# Altium project AMBIT.PrjPcb (part 2 of 3)

## Sheet Microcontroller.SchDoc: Microcontroller
size Tabloid; DocumentNumber: 1; Revision: 0.4b; SheetNumber: 1; SheetTotal: 11
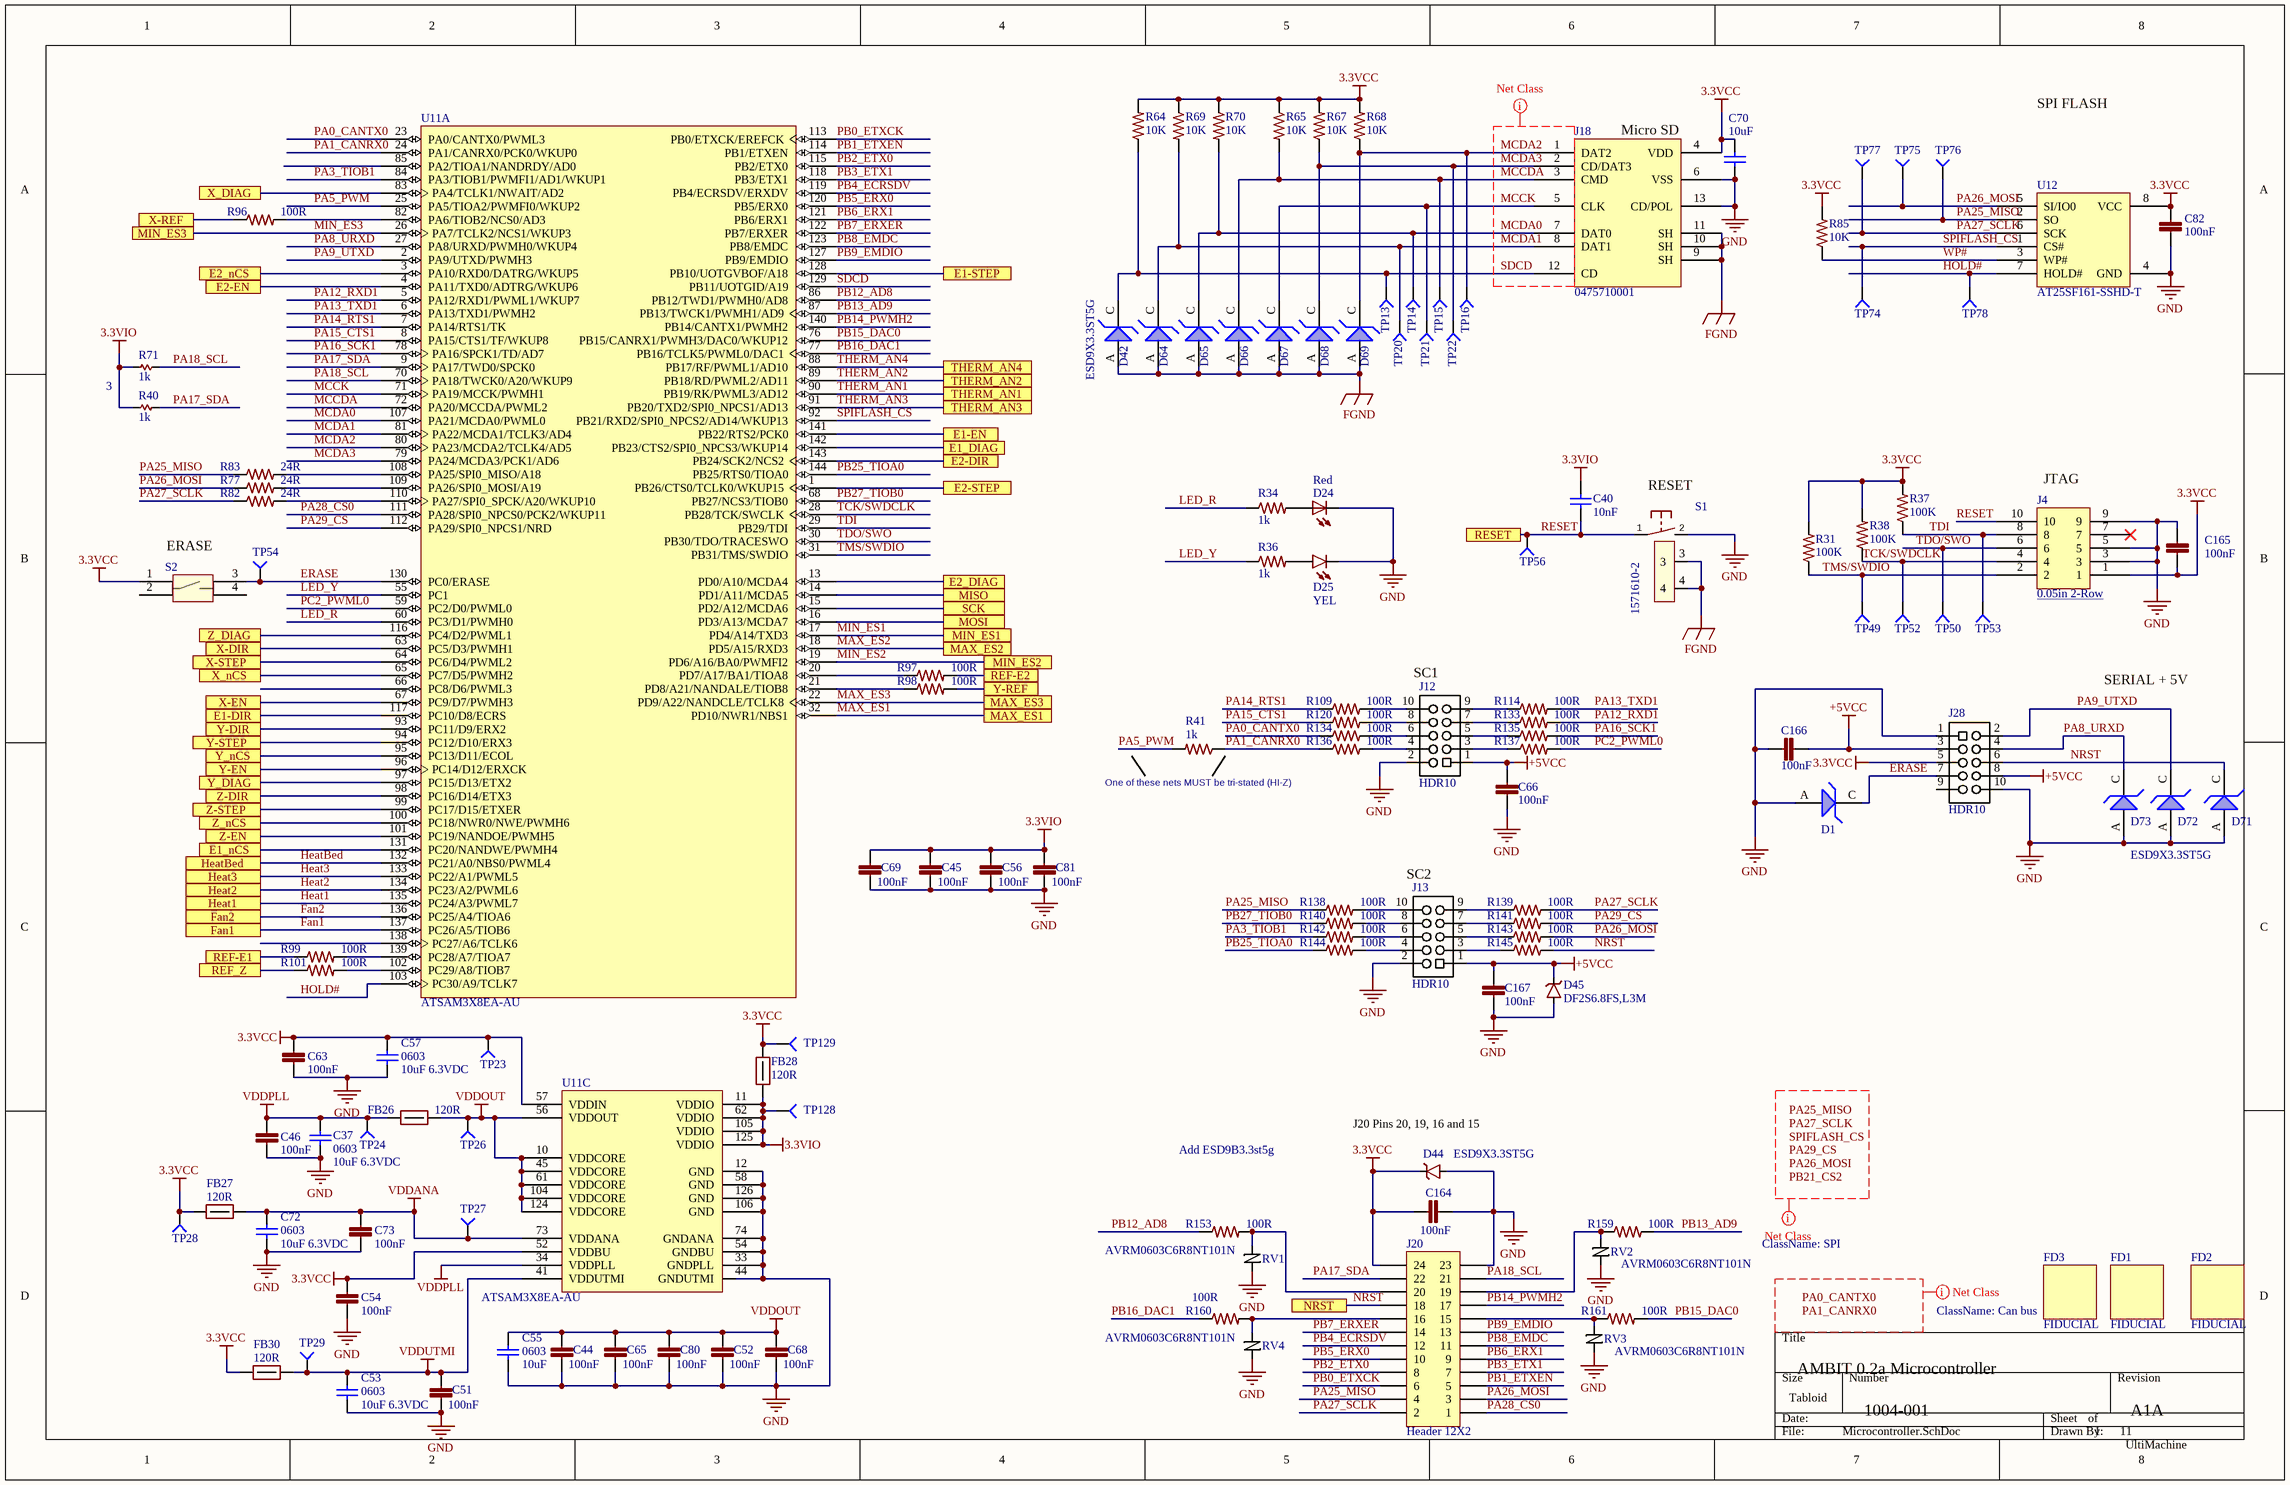
[diagram p3: Microcontroller.SchDoc]

### Parts
(Parts that share a designator on the sheet are numbered #1, #2 ... from top to bottom, then left to right.)
C37  0603  value 10uF 6.3VDC  [C0603]
C40  10nF  [C0402]
C44  100nF  [C0402]
C45  100nF  [C0402]
C46  100nF  [C0402]
C51  100nF  [C0402]
C52  100nF  [C0402]
C53  0603  value 10uF 6.3VDC  [C0603]
C54  100nF  [C0402]
C55  0603  value 10uF  [C0603]
C56  100nF  [C0402]
C57  0603  value 10uF 6.3VDC  [C0603]
C63  100nF  [C0402]
C65  100nF  [C0402]
C66  100nF  [C0402]
C68  100nF  [C0402]
C69  100nF  [C0402]
C70  value 10uF  [C0603]  (hidden comment: 0603)
C72  0603  value 10uF 6.3VDC  [C0603]
C73  100nF  [C0402]
C80  100nF  [C0402]
C81  100nF  [C0402]
C82  100nF  [C0402]
C164  100nF  [C0402]
C165  100nF  [C0402]
C166  100nF  [C0402]
C167  100nF  [C0402]
D1  ESD9X3.3ST5G  [SOD923-100X40-2N]  (value not drawn)
D24  Red  [LED2012120]
D25  YEL  [LED2012120]
D42  ESD9X3.3ST5G  [SOD923-100X40-2N]
D44  ESD9X3.3ST5G  [SOD923-D]
D45  DF2S6.8FS,L3M  [SOD923-D]
D64  ESD9X3.3ST5G  [SOD923-100X40-2N]  (value not drawn)
D65  ESD9X3.3ST5G  [SOD923-100X40-2N]  (value not drawn)
D66  ESD9X3.3ST5G  [SOD923-100X40-2N]  (value not drawn)
D67  ESD9X3.3ST5G  [SOD923-100X40-2N]  (value not drawn)
D68  ESD9X3.3ST5G  [SOD923-100X40-2N]  (value not drawn)
D69  ESD9X3.3ST5G  [SOD923-100X40-2N]  (value not drawn)
D71  ESD9X3.3ST5G  [SOD923-100X40-2N]
D72  ESD9X3.3ST5G  [SOD923-100X40-2N]  (value not drawn)
D73  ESD9X3.3ST5G  [SOD923-100X40-2N]  (value not drawn)
FB26  120R  [FB0603]
FB27  120R  [FB0603]
FB28  120R  [FB0603]
FB30  120R  [FB0603]
FD1  FIDUCIAL  [FIDUCIAL-1X2]
FD2  FIDUCIAL  [FIDUCIAL-1X2]
FD3  FIDUCIAL  [FIDUCIAL-1X2]
J4  0.05in 2-Row  [FTSH-105-XX-X-DV]
J12  HDR10  [HDR2X5 IDC]
J13  HDR10  [HDR2X5 IDC]
J18  0475710001  [SD_MICRO 475710001]
J20  Header 12X2  [HDR2X12]
J28  HDR10  [HDR2X5 IDC]
R31  100K  [R0402]
R34  1k  [R0402]
R36  1k  [R0402]
R37  100K  [R0402]
R38  100K  [R0402]
R40  1k  [R0402]
R41  1k  [R0402]
R64  10K  [R0402]
R65  10K  [R0402]
R67  10K  [R0402]
R68  10K  [R0402]
R69  10K  [R0402]
R70  10K  [R0402]
R71  1k  [R0402]
R77  24R  [R0402]
R82  24R  [R0402]
R83  24R  [R0402]
R85  10K  [R0402]
R96  100R  [R0402]
R97  100R  [R0402]
R98  100R  [R0402]
R99  100R  [R0402]
R101  100R  [R0402]
R109  100R  [R0402]
R114  100R  [R0402]
R120  100R  [R0402]
R133  100R  [R0402]
R134  100R  [R0402]
R135  100R  [R0402]
R136  100R  [R0402]
R137  100R  [R0402]
R138  100R  [R0402]
R139  100R  [R0402]
R140  100R  [R0402]
R141  100R  [R0402]
R142  100R  [R0402]
R143  100R  [R0402]
R144  100R  [R0402]
R145  100R  [R0402]
R153  100R  [R0402]
R159  100R  [R0402]
R160  100R  [R0402]
R161  100R  [R0402]
RV1  AVRM0603C6R8NT101N  [C0201 Large Pads]
RV2  AVRM0603C6R8NT101N  [C0201 Large Pads]
RV3  AVRM0603C6R8NT101N  [C0201 Large Pads]
RV4  AVRM0603C6R8NT101N  [C0201 Large Pads]
S1  1571610-2  [B3F-31XX]
S2  KMR741NG ULC LFS  [KMR 6 Series]  (value not drawn)
TP13  TP4  [TP-2]  (value not drawn)  (no BOM)
TP14  TP4  [TP-2]  (value not drawn)  (no BOM)
TP15  TP4  [TP-2]  (value not drawn)  (no BOM)
TP16  TP4  [TP-2]  (value not drawn)  (no BOM)
TP20  TP4  [TP-2]  (value not drawn)  (no BOM)
TP21  TP4  [TP-2]  (value not drawn)  (no BOM)
TP22  TP4  [TP-2]  (value not drawn)  (no BOM)
TP23  TP4  [TP-2]  (value not drawn)  (no BOM)
TP24  TP4  [TP-2]  (value not drawn)  (no BOM)
TP26  TP4  [TP-2]  (value not drawn)  (no BOM)
TP27  TP4  [TP-2]  (value not drawn)  (no BOM)
TP28  TP4  [TP-2]  (value not drawn)  (no BOM)
TP29  TP4  [TP-2]  (value not drawn)  (no BOM)
TP49  TP4  [TP-2]  (value not drawn)  (no BOM)
TP50  TP4  [TP-2]  (value not drawn)  (no BOM)
TP52  TP4  [TP-2]  (value not drawn)  (no BOM)
TP53  TP4  [TP-2]  (value not drawn)  (no BOM)
TP54  TP4  [TP-2]  (value not drawn)  (no BOM)
TP56  TP4  [TP-2]  (value not drawn)  (no BOM)
TP74  TP4  [TP-2]  (value not drawn)  (no BOM)
TP75  TP4  [TP-2]  (value not drawn)  (no BOM)
TP76  TP4  [TP-2]  (value not drawn)  (no BOM)
TP77  TP4  [TP-2]  (value not drawn)  (no BOM)
TP78  TP4  [TP-2]  (value not drawn)  (no BOM)
TP128  TP4  [TP-2]  (value not drawn)  (no BOM)
TP129  TP4  [TP-2]  (value not drawn)  (no BOM)
U11#1  ATSAM3X8EA-AU  [LQFP144_N]  (part C of 3)
U11#2  ATSAM3X8EA-AU  [LQFP144_N]  (part A of 3)
U12  AT25SF161-SSHD-T  [S25FL216K0PMFI041]

### Ports
E1-DIR, E1-EN, E1-STEP, E1_DIAG, E1_nCS, E2-DIR, E2-EN, E2-STEP, E2_DIAG, E2_nCS, Fan1, Fan2, Heat1, Heat2, Heat3, HeatBed, MAX_ES1, MAX_ES2, MAX_ES3, MIN_ES1, MIN_ES2, MIN_ES3, MISO, MOSI, NRST, REF-E1, REF-E2, REF_Z, RESET, SCK, THERM_AN1, THERM_AN2, THERM_AN3, THERM_AN4, X-DIR, X-EN, X-REF, X-STEP, X_DIAG, X_nCS, Y-DIR, Y-EN, Y-REF, Y-STEP, Y_DIAG, Y_nCS, Z-DIR, Z-EN, Z-STEP, Z_DIAG, Z_nCS

### Nets
3.3VCC: C54.1 C57.2 C63.1 C70.2 C82.1 C164.1 C165.2 D44.K FB27.1 FB28.2 FB30.1 J4.1 J18.4(VDD) J20.24 J28.5 R31.2 R37.2 R38.2 R64.2 R65.1 R67.2 R68.2 R69.1 R70.1 R85.2 S2.1 TP23.1 TP28.1 TP129.1 U11#1.52(VDDBU) U11#1.57(VDDIN) U12.8(VCC)
3.3VIO: C40.2 C45.1 C56.1 C69.1 C81.1 FB28.1 R40.1 R71.1 TP128.1 U11#1.11(VDDIO) U11#1.62(VDDIO) U11#1.105(VDDIO) U11#1.125(VDDIO)
+5VCC: C66.2 C166.1 C167.2 D45.K J12.1 J13.1 J28.3 J28.8
FGND: D42.A D64.A D65.A D66.A D67.A D68.A D69.A J18.9(SH) J18.10(SH) J18.11(SH) S1.3 S1.4
GND: C37.1 C44.2 C45.2 C46.2 C51.2 C52.2 C53.1 C54.2 C55.1 C56.2 C57.1 C63.2 C65.2 C66.1 C68.2 C69.2 C70.1 C72.1 C73.2 C80.2 C81.2 C82.2 C164.2 C165.1 C166.2 C167.1 D1.A D24.C D25.C D44.A D45.A D71.A D72.A D73.A J4.3 J4.5 J4.9 J12.2 J13.2 J18.6(VSS) J18.13(CD/POL) J20.23 J28.1 J28.10 RV1.2 RV2.2 RV3.2 RV4.2 S1.2(S) U11#1.12(GND) U11#1.33(GNDPLL) U11#1.44(GNDUTMI) U11#1.54(GNDBU) U11#1.58(GND) U11#1.74(GNDANA) U11#1.106(GND) U11#1.126(GND) U12.4(GND)
VDDANA: C72.2 C73.1 FB27.2 TP27.1 U11#1.73(VDDANA)
VDDOUT: C44.1 C52.1 C55.2 C65.1 C68.1 C80.1 FB26.2 TP26.1 U11#1.10(VDDCORE) U11#1.45(VDDCORE) U11#1.56(VDDOUT) U11#1.61(VDDCORE) U11#1.104(VDDCORE) U11#1.124(VDDCORE)
VDDPLL: C37.2 C46.1 FB26.1 TP24.1 U11#1.34(VDDPLL)
VDDUTMI: C51.1 C53.2 FB30.2 TP29.1 U11#1.41(VDDUTMI)
ERASE: D1.C J28.7 S2.3 TP54.1 U11#2.130(PC0/ERASE)
Fan1: U11#2.137(PC26/A5/TIOB6) ; port Fan1
Fan2: U11#2.136(PC25/A4/TIOA6) ; port Fan2
Heat1: U11#2.135(PC24/A3/PWML7) ; port Heat1
Heat2: U11#2.134(PC23/A2/PWML6) ; port Heat2
Heat3: U11#2.133(PC22/A1/PWML5) ; port Heat3
HeatBed: U11#2.132(PC21/A0/NBS0/PWML4) ; port HeatBed
HOLD#: TP78.1 U11#2.103(PC30/A9/TCLK7) U12.7(HOLD#)
LED_R: R34.1 U11#2.60(PC3/D1/PWMH0)
LED_Y: R36.1 U11#2.55(PC1)
MAX_ES1: U11#2.32(PD10/NWR1/NBS1) ; port MAX_ES1
MAX_ES2: U11#2.18(PD5/A15/RXD3) ; port MAX_ES2
MAX_ES3: U11#2.22(PD9/A22/NANDCLE/TCLK8) ; port MAX_ES3
MCCDA: D66.C J18.3(CMD) R65.2 TP15.1 U11#2.72(PA20/MCCDA/PWML2)
MCCK: D67.C J18.5(CLK) TP21.1 U11#2.71(PA19/MCCK/PWMH1)
MCDA0: D65.C J18.7(DAT0) R70.2 TP14.1 U11#2.107(PA21/MCDA0/PWML0)
MCDA1: D64.C J18.8(DAT1) R69.2 TP20.1 U11#2.81(PA22/MCDA1/TCLK3/AD4)
MCDA2: D69.C J18.1(DAT2) R68.1 TP16.1 U11#2.80(PA23/MCDA2/TCLK4/AD5)
MCDA3: D68.C J18.2(CD/DAT3) R67.1 TP22.1 U11#2.79(PA24/MCDA3/PCK1/AD6)
MIN_ES1: U11#2.17(PD4/A14/TXD3) ; port MIN_ES1
MIN_ES2: U11#2.19(PD6/A16/BA0/PWMFI2) ; port MIN_ES2
MIN_ES3: U11#2.26(PA7/TCLK2/NCS1/WKUP3) ; port MIN_ES3
NRST: D71.C J20.18 J28.6 R145.2 ; port NRST
PA0_CANTX0: R134.1 U11#2.23(PA0/CANTX0/PWML3)
PA1_CANRX0: R41.1 R136.1 U11#2.24(PA1/CANRX0/PCK0/WKUP0)
PA3_TIOB1: R142.1 U11#2.84(PA3/TIOB1/PWMFI1/AD1/WKUP1)
PA5_PWM: R41.2 U11#2.25(PA5/TIOA2/PWMFI0/WKUP2)
PA8_URXD: D73.C J28.4 U11#2.27(PA8/URXD/PWMH0/WKUP4)
PA9_UTXD: D72.C J28.2 U11#2.2(PA9/UTXD/PWMH3)
PA12_RXD1: R133.2 U11#2.5(PA12/RXD1/PWML1/WKUP7)
PA13_TXD1: R114.2 U11#2.6(PA13/TXD1/PWMH2)
PA14_RTS1: R109.1 U11#2.7(PA14/RTS1/TK)
PA15_CTS1: R120.1 U11#2.8(PA15/CTS1/TF/WKUP8)
PA16_SCK1: R135.2 U11#2.78(PA16/SPCK1/TD/AD7)
PA17_SDA: J20.22 R40.2 U11#2.9(PA17/TWD0/SPCK0)
PA18_SCL: J20.21 R71.2 U11#2.70(PA18/TWCK0/A20/WKUP9)
PA25_MISO: J20.4 R83.1 R138.1 TP76.1 U12.2(SO)
PA26_MOSI: J20.3 R77.1 R143.2 TP75.1 U12.5(SI/IO0)
PA27_SCLK: J20.2 R82.1 R139.2 TP77.1 U12.6(SCK)
PA28_CS0: J20.1 U11#2.111(PA28/SPI0_NPCS0/PCK2/WKUP11)
PA29_CS: R141.2 U11#2.112(PA29/SPI0_NPCS1/NRD)
PB0_ETXCK: J20.6 U11#2.113(PB0/ETXCK/EREFCK)
PB1_ETXEN: J20.5 U11#2.114(PB1/ETXEN)
PB2_ETX0: J20.8 U11#2.115(PB2/ETX0)
PB3_ETX1: J20.7 U11#2.118(PB3/ETX1)
PB4_ECRSDV: J20.12 U11#2.119(PB4/ECRSDV/ERXDV)
PB5_ERX0: J20.10 U11#2.120(PB5/ERX0)
PB6_ERX1: J20.9 U11#2.121(PB6/ERX1)
PB7_ERXER: J20.14 U11#2.122(PB7/ERXER)
PB8_EMDC: J20.11 U11#2.123(PB8/EMDC)
PB9_EMDIO: J20.13 U11#2.127(PB9/EMDIO)
PB12_AD8: R153.1 U11#2.86(PB12/TWD1/PWMH0/AD8)
PB13_AD9: R159.2 U11#2.87(PB13/TWCK1/PWMH1/AD9)
PB14_PWMH2: J20.17 U11#2.140(PB14/CANTX1/PWMH2)
PB15_DAC0: R161.2 U11#2.76(PB15/CANRX1/PWMH3/DAC0/WKUP12)
PB16_DAC1: R160.1 U11#2.77(PB16/TCLK5/PWML0/DAC1)
PB25_TIOA0: R144.1 U11#2.144(PB25/RTS0/TIOA0)
PB27_TIOB0: R140.1 U11#2.68(PB27/NCS3/TIOB0)
PC2_PWML0: R137.2 U11#2.59(PC2/D0/PWML0)
RESET: C40.1 J4.10 S1.1(P) TP56.1 ; port RESET
SDCD: D42.C J18.12(CD) R64.1 TP13.1 U11#2.129(PB11/UOTGID/A19)
SPIFLASH_CS: TP74.1 U11#2.92(PB21/RXD2/SPI0_NPCS2/AD14/WKUP13) U12.1(CS#)
TCK/SWDCLK: J4.4 R38.1 TP52.1 U11#2.28(PB28/TCK/SWCLK)
TDI: J4.8 R37.1 TP53.1 U11#2.29(PB29/TDI)
TDO/SWO: J4.6 TP50.1 U11#2.30(PB30/TDO/TRACESWO)
THERM_AN1: U11#2.90(PB19/RK/PWML3/AD12) ; port THERM_AN1
THERM_AN2: U11#2.89(PB18/RD/PWML2/AD11) ; port THERM_AN2
THERM_AN3: U11#2.91(PB20/TXD2/SPI0_NPCS1/AD13) ; port THERM_AN3
THERM_AN4: U11#2.88(PB17/RF/PWML1/AD10) ; port THERM_AN4
TMS/SWDIO: J4.2 R31.1 TP49.1 U11#2.31(PB31/TMS/SWDIO)
WP#: R85.1 U12.3(WP#)
NetD24_A: D24.A R34.2
NetD25_A: D25.A R36.2
NetJ12_3: J12.3 R137.1
NetJ12_4: J12.4 R136.2
NetJ12_5: J12.5 R135.1
NetJ12_6: J12.6 R134.2
NetJ12_7: J12.7 R133.1
NetJ12_8: J12.8 R120.2
NetJ12_9: J12.9 R114.1
NetJ12_10: J12.10 R109.2
NetJ13_3: J13.3 R145.1
NetJ13_4: J13.4 R144.2
NetJ13_5: J13.5 R143.1
NetJ13_6: J13.6 R142.2
NetJ13_7: J13.7 R141.1
NetJ13_8: J13.8 R140.2
NetJ13_9: J13.9 R139.1
NetJ13_10: J13.10 R138.2
NetJ20_15: J20.15 R161.1 RV3.1
NetJ20_16: J20.16 R160.2 RV4.1
NetJ20_19: J20.19 R159.1 RV2.1
NetJ20_20: J20.20 R153.2 RV1.1
NetR77_2: R77.2 U11#2.109(PA26/SPI0_MOSI/A19)
NetR82_2: R82.2 U11#2.110(PA27/SPI0_SPCK/A20/WKUP10)
NetR83_2: R83.2 U11#2.108(PA25/SPI0_MISO/A18)
NetR96_1: R96.1 ; port X-REF
NetR96_2: R96.2 U11#2.82(PA6/TIOB2/NCS0/AD3)
NetR97_1: R97.1 U11#2.20(PD7/A17/BA1/TIOA8)
NetR97_2: R97.2 ; port REF-E2
NetR98_1: R98.1 U11#2.21(PD8/A21/NANDALE/TIOB8)
NetR98_2: R98.2 ; port Y-REF
NetR99_1: R99.1 ; port REF-E1
NetR99_2: R99.2 U11#2.139(PC28/A7/TIOA7)
NetR101_1: R101.1 ; port REF_Z
NetR101_2: R101.2 U11#2.102(PC29/A8/TIOB7)
NetR130_1: U11#2.116(PC4/D2/PWML1) ; port Z_DIAG
NetU11#2_1: U11#2.1(PB26/CTS0/TCLK0/WKUP15) ; port E2-STEP
NetU11#2_3: U11#2.3(PA10/RXD0/DATRG/WKUP5) ; port E2_nCS
NetU11#2_4: U11#2.4(PA11/TXD0/ADTRG/WKUP6) ; port E2-EN
NetU11#2_13: U11#2.13(PD0/A10/MCDA4) ; port E2_DIAG
NetU11#2_14: U11#2.14(PD1/A11/MCDA5) ; port MISO
NetU11#2_15: U11#2.15(PD2/A12/MCDA6) ; port SCK
NetU11#2_16: U11#2.16(PD3/A13/MCDA7) ; port MOSI
NetU11#2_63: U11#2.63(PC5/D3/PWMH1) ; port X-DIR
NetU11#2_64: U11#2.64(PC6/D4/PWML2) ; port X-STEP
NetU11#2_65: U11#2.65(PC7/D5/PWMH2) ; port X_nCS
NetU11#2_67: U11#2.67(PC9/D7/PWMH3) ; port X-EN
NetU11#2_83: U11#2.83(PA4/TCLK1/NWAIT/AD2) ; port X_DIAG
NetU11#2_93: U11#2.93(PC11/D9/ERX2) ; port Y-DIR
NetU11#2_94: U11#2.94(PC12/D10/ERX3) ; port Y-STEP
NetU11#2_95: U11#2.95(PC13/D11/ECOL) ; port Y_nCS
NetU11#2_96: U11#2.96(PC14/D12/ERXCK) ; port Y-EN
NetU11#2_97: U11#2.97(PC15/D13/ETX2) ; port Y_DIAG
NetU11#2_98: U11#2.98(PC16/D14/ETX3) ; port Z-DIR
NetU11#2_99: U11#2.99(PC17/D15/ETXER) ; port Z-STEP
NetU11#2_100: U11#2.100(PC18/NWR0/NWE/PWMH6) ; port Z_nCS
NetU11#2_101: U11#2.101(PC19/NANDOE/PWMH5) ; port Z-EN
NetU11#2_117: U11#2.117(PC10/D8/ECRS) ; port E1-DIR
NetU11#2_128: U11#2.128(PB10/UOTGVBOF/A18) ; port E1-STEP
NetU11#2_131: U11#2.131(PC20/NANDWE/PWMH4) ; port E1_nCS
NetU11#2_141: U11#2.141(PB22/RTS2/PCK0) ; port E1-EN
NetU11#2_142: U11#2.142(PB23/CTS2/SPI0_NPCS3/WKUP14) ; port E1_DIAG
NetU11#2_143: U11#2.143(PB24/SCK2/NCS2) ; port E2-DIR

Not connected (* = marked no-connect by the designer): J4 7*; J28 9; S2 2 4; U11#2 66(PC8/D6/PWML3) 85(PA2/TIOA1/NANDRDY/AD0) 138(PC27/A6/TCLK6)

### Layout directives
net class SD: MCCDA, MCCK, MCDA0, MCDA1, MCDA2, MCDA3, SDCD
net class Can bus: PA0_CANTX0, PA1_CANRX0
net class SPI: PA25_MISO, PA26_MOSI, PA27_SCLK, PA29_CS, PB21_CS2, SPIFLASH_CS

### Notes on the sheet
- (near J18) Micro SD
- SPI FLASH
- 3
- (near S1) RESET
- (near J4) JTAG
- (near S2) ERASE
- (near J12) SC1
- SERIAL + 5V
- One of these nets MUST be tri-stated (HI-Z)
- (near J13) SC2
- Add ESD9B3.3st5g
- (near D44) J20 Pins 20, 19, 16 and 15
- Labels drawn without touching a wire or pin: PA0_CANTX0, PA1_CANRX0, PA25_MISO, PA26_MOSI, PA27_SCLK, PA29_CS, PB21_CS2, SPIFLASH_CS

### Library data of the parts
C37 C53 C55 C57 C70 C72 = C1608JB0J106K080AB: CAP CER 10UF 6.3V 10% JB 0603; MANUFACTURER: TDK; PART: 10µF ±10% 6.3V Ceramic Capacitor JB 0603 (1608 Metric); EE_SPEC: 6.3VDC; PART DESCRIPTION: CAP CER 10UF 6.3V 10% JB 0603; TOLERANCE: 10%; MANUFACTURER #: C1608JB0J106K080AB; DISTRIBUTOR #: 445-11185-1-ND; DISTRIBUTOR: Digi-Key Electronics
C40 = GRM155R71H103JA88D: CAP CER 10nF 50V X7R 0402; PART DESCRIPTION: 10000pF ±5% 50V Ceramic Capacitor X7R 0402 (1005 Metric); MANUFACTURER: Murata; TOLERANCE: 5%; EE_SPEC: 50V; VALUE: 10nF; MANUFACTURER #: GRM155R71H103JA88D; DISTRIBUTOR #: 490-7763-1-ND; DISTRIBUTOR: Digi-Key Electronics; PART: 10nF 50V X7R 0402
C44-C46 C51 C52 C54 C56 C63 C65 C66 C68 C69 C73 C80-C82 C164-C167 = GRM155R71C104KA88D: as C26 on sheet Power; VALUE: 100nF; MANUFACTURER #: GRM155R71C104KA88D; DISTRIBUTOR #: 490-3261-2-ND; DISTRIBUTOR: Digi-Key Electronics; TOLERANCE: 10%
D1 D42 D44 D64-D69 D71-D73 = ESD9X3.3ST5G: TVS DIODE 3.3VWM 10.4VC SOD923; MANUFACTURER: On Semi; PART: TVS DIODE 3.3VWM SOD923; TOLERANCE: -NA-; VALUE: 3.3V; EE_SPEC: 3.3Vso 15pF; MANUFACTURER #: ESD9X3.3ST5G; DISTRIBUTOR #: ESD9X3.3ST5GOSCT-ND; PART DESCRIPTION: TVS DIODE 3.3VWM SOD923
  D1 D42 D64-D69 D71-D73: DISTRIBUTOR: Digi-Key Electronics
  D44: DISTRIBUTOR: Digikey
D24 = 5988110107F: LED 0805 Red; MANUFACTURER: Dialight; PART: LED Red 0805; PART DESCRIPTION: Red 635nm LED Indication - Discrete 2.2V 0805 (2012 Metric); TOLERANCE: -NA-; EE_SPEC: Vf=2.2V; VALUE: Red; MANUFACTURER #: 5988110107F; DISTRIBUTOR #: 350-2038-2-ND; DISTRIBUTOR: Digi-Key Electronics
D25 = 5988140107F: LED 0805 Yellow; MANUFACTURER: Dialight; PART: LED Yellow 0805; PART DESCRIPTION: Yellow 593nm LED Indication - Discrete 2V 0805 (2012 Metric); TOLERANCE: -NA-; EE_SPEC: Vf=2V; VALUE: YEL; MANUFACTURER #: 5988140107F; DISTRIBUTOR #: 350-2041-2-ND; DISTRIBUTOR: Digi-Key Electronics
D45 = DF2S6.8FS,L3M: TVS DIODE 5V 9V SOD923; MANUFACTURER: Toshiba; EE_SPEC: 5Vso; MANUFACTURER #: DF2S6.8FS,L3M; PART DESCRIPTION: TVS DIODE 5V 9V SOD923; VALUE: 5V
FB26-FB28 FB30 = FERRITE 120R 3A 0603: as FB22 on sheet Power; DISTRIBUTOR #: 1276-6351-2-ND; DISTRIBUTOR: Digi-Key Electronics; PART: FERRITE 120R 3A 0603; PART DESCRIPTION: FERRITE BEAD 120 OHM 0603 1LN
FD1-FD3 = FIDUCIAL: MANUFACTURER #: NOTAPART-Fiducial
J4 = ARM Cortex JTAG-DEBUG Header: 20021121-00010C4LF; MANUFACTURER: Amphenol FCI; PART: 10 Pin Conn 2Row SMT; PART DESCRIPTION: 10 Positions Header, Unshrouded Connector 0.050" (1.27mm) Surface Mount Gold; TOLERANCE: -NA-; VALUE: HDR10; MANUFACTURER #: 20021121-00010C4LF; DISTRIBUTOR #: 609-3695-2-ND; DISTRIBUTOR: Digi-Key Electronics; EE_SPEC: -NA-
J12 J13 J28 = Header 10PIN 2ROW T-HOLE VERT SHROUDED: CONN HEADER VERT 10POS GOLD; MANUFACTURER #: 302-S101; MANUFACTURER: On Shore; PART DESCRIPTION: 10 Positions Header Connector 0.100" (2.54mm) Through Hole Gold; TOLERANCE: -NA-; DISTRIBUTOR #: ED1543-ND; DISTRIBUTOR: Digikey; PART: HDR10; VALUE: HDR10; EE_SPEC: -NA-
J18 = 0475710001: microSD 0475710001Molex Part; MANUFACTURER: Molex; PART: CONN Micro SD; PART DESCRIPTION: 10 (8 + 2) Position Card Connector Secure Digital - microSD™ Surface Mount, Right Angle Gold; TOLERANCE: -NA-; VALUE: SD Conn; MANUFACTURER #: 0475710001; DISTRIBUTOR #: WM9731TR-ND; DISTRIBUTOR: Digikey; EE_SPEC: -NA-
J20 = Header 12X2: Header, 12-Pin, Dual row; MANUFACTURER #: 2213S-24G; MANUFACTURER: Multicomp; PART: CONN 24Pin 2Row 0.1"; PART DESCRIPTION: Board-To-Board Connector, 2.54 mm, 24 Contacts, Header, 2213S Series, Through Hole, 2 Rows; TOLERANCE: -NA-; VALUE: HDR24; DISTRIBUTOR #: 08N6796; DISTRIBUTOR: Future; EE_SPEC: -NA-
R31 R37 R38 = RC1005F104CS: RES SMD 100K OHM 1% 1/16W 0402; MANUFACTURER: Samsung; PART: 100k 1% 0402; PART DESCRIPTION: 100k Ohm ±1% 0.063W, 1/16W Chip Resistor 0402 (1005 Metric) Moisture Resistant Thick Film; VALUE: 100K; MANUFACTURER #: RC1005F104CS; DISTRIBUTOR #: 1276-3432-1-ND; DISTRIBUTOR: Digi-Key Electronics; TOLERANCE: 1%; EE_SPEC: 1/16W
R34 R36 R41 = RK73H1ETTP1001F: RES 0402 1k 63mW 1%; MANUFACTURER: Yageo; MANUFACTURER #: RC0402FR-071KL; PART: 1k 1% 0402; PART DESCRIPTION: 1k Ohm ±1% 0.063W, 1/16W Chip Resistor 0402 (1005 Metric) Moisture Resistant Thick Film; EE_SPEC: 1/16W; VALUE: 1k; DISTRIBUTOR #: 311-1.00KLRTR-ND; DISTRIBUTOR: Digi-Key Electronics; TOLERANCE: 1%
R40 R71 = 1k 1% 0402: RES 0402 1k 63mW 1%; MANUFACTURER: Yageo; MANUFACTURER #: RC0402FR-071KL; PART DESCRIPTION: 1k Ohm ±1% 0.063W, 1/16W Chip Resistor 0402 (1005 Metric) Moisture Resistant Thick Film; EE_SPEC: 1/16W; DISTRIBUTOR #: 311-1.00KLRTR-ND; DISTRIBUTOR: Digi-Key Electronics; PART: 1k 1% 0402; TOLERANCE: 1%; VALUE: 1k
R64 R65 R67-R70 R85 = RC0402FR-0710KP: as R150 on sheet USB; VALUE: 10K; MANUFACTURER #: RC0402FR-0710KP; DISTRIBUTOR #: YAG1249TR-ND; DISTRIBUTOR: Digi-Key Electronics; TOLERANCE: 1%; EE_SPEC: 1/16W
R77 R82 R83 = CRCW040224R0FKED: Res Thick Film 0402 24 Ohm 1% 0.063W; MANUFACTURER: Yageo; MANUFACTURER #: RC0402FR-0724RL; PART: 24R 1% 0402; PART DESCRIPTION: 24 Ohm ±1% 0.063W, 1/16W Chip Resistor 0402 (1005 Metric) Moisture Resistant Thick Film; EE_SPEC: 1/16W; VALUE: 24R; DISTRIBUTOR #: YAG3073TR-ND; DISTRIBUTOR: Digi-Key Electronics; TOLERANCE: 1%
R96-R99 R101 R109 R114 R120 R133-R145 R153 R159-R161 = RES 100R 0402 1%: as R149 on sheet USB; VALUE: 100R; DISTRIBUTOR #: 311-100LRTR-ND; DISTRIBUTOR: Digi-Key Electronics; TOLERANCE: 1%; EE_SPEC: 1/16W
RV1-RV4 = AVRM0603C6R8NT101N: VARISTOR 6.8V 10A 0201; MANUFACTURER: TDK; TOLERANCE: -NA-; EE_SPEC: 3.5Vso 100pF; MANUFACTURER #: AVRM0603C6R8NT101N; PART DESCRIPTION: VARISTOR 6.8V 10A 0201; VALUE: 6.8V
S1 = 1571610-2: SWTCH Momentary Washable; MANUFACTURER: TE; PART: Tactile Pushbutton; PART DESCRIPTION: Tactile Switches R/A SEALED TACT SWITCH; TOLERANCE: -NA-; VALUE: -NA-; EE_SPEC: 24V; MANUFACTURER #: 1571610-2; DISTRIBUTOR #: 506-1571610-2; DISTRIBUTOR: Mouser
S2 = KMR741NG ULC LFS: SWITCH TACTILE SPST-NO 0.05A 12V; MANUFACTURER: C&K; PART: Tactile Pushbutton SMT; PART DESCRIPTION: Tactile Switch SPST-NO Top Actuated Surface Mount; TOLERANCE: -NA-; VALUE: -NA-; EE_SPEC: 32V 50mA; MANUFACTURER #: KMR741NG ULC LFS; DISTRIBUTOR #: CKN10688TR-ND; DISTRIBUTOR: Digi-Key Electronics
TP13-TP16 TP20-TP24 TP26-TP29 TP49 TP50 TP52-TP54 TP56 TP74-TP78 TP128 TP129 = Socket: MANUFACTURER #: NOTAPART-Testpoint
U11#1 U11#2 = ATML-ATSAM3X-LQFP-144: Atmel; PART: IC MCU 32BIT 512KB FLASH 144LQFP; PART DESCRIPTION: ARM® Cortex®-M3 SAM3X Microcontroller IC 32-Bit 84MHz 512KB (512K x 8) FLASH 144-LQFP (20x20); TOLERANCE: -NA-; VALUE: -NA-; EE_SPEC: 3.3V; MANUFACTURER #: ATSAM3X8EA-AU; MANUFACTURER: Atmel; DISTRIBUTOR #: ATSAM3X8EA-AU-ND; DISTRIBUTOR: Digi-Key Electronics
U12 = AT25SF161-SSHD-T: IC FLASH 16M SPI 104MHZ 8SOIC; MANUFACTURER: Adesto; TOLERANCE: -NA-; VALUE: 16Mb; EE_SPEC: 3.3V; MANUFACTURER #: AT25SF161-SSHD-T; PART DESCRIPTION: IC FLASH 16M SPI 104MHZ 8SOIC

## Sheet Motors.SchDoc: Motors
size Letter; DocumentNumber: 3; SheetNumber: 3; SheetTotal: 8
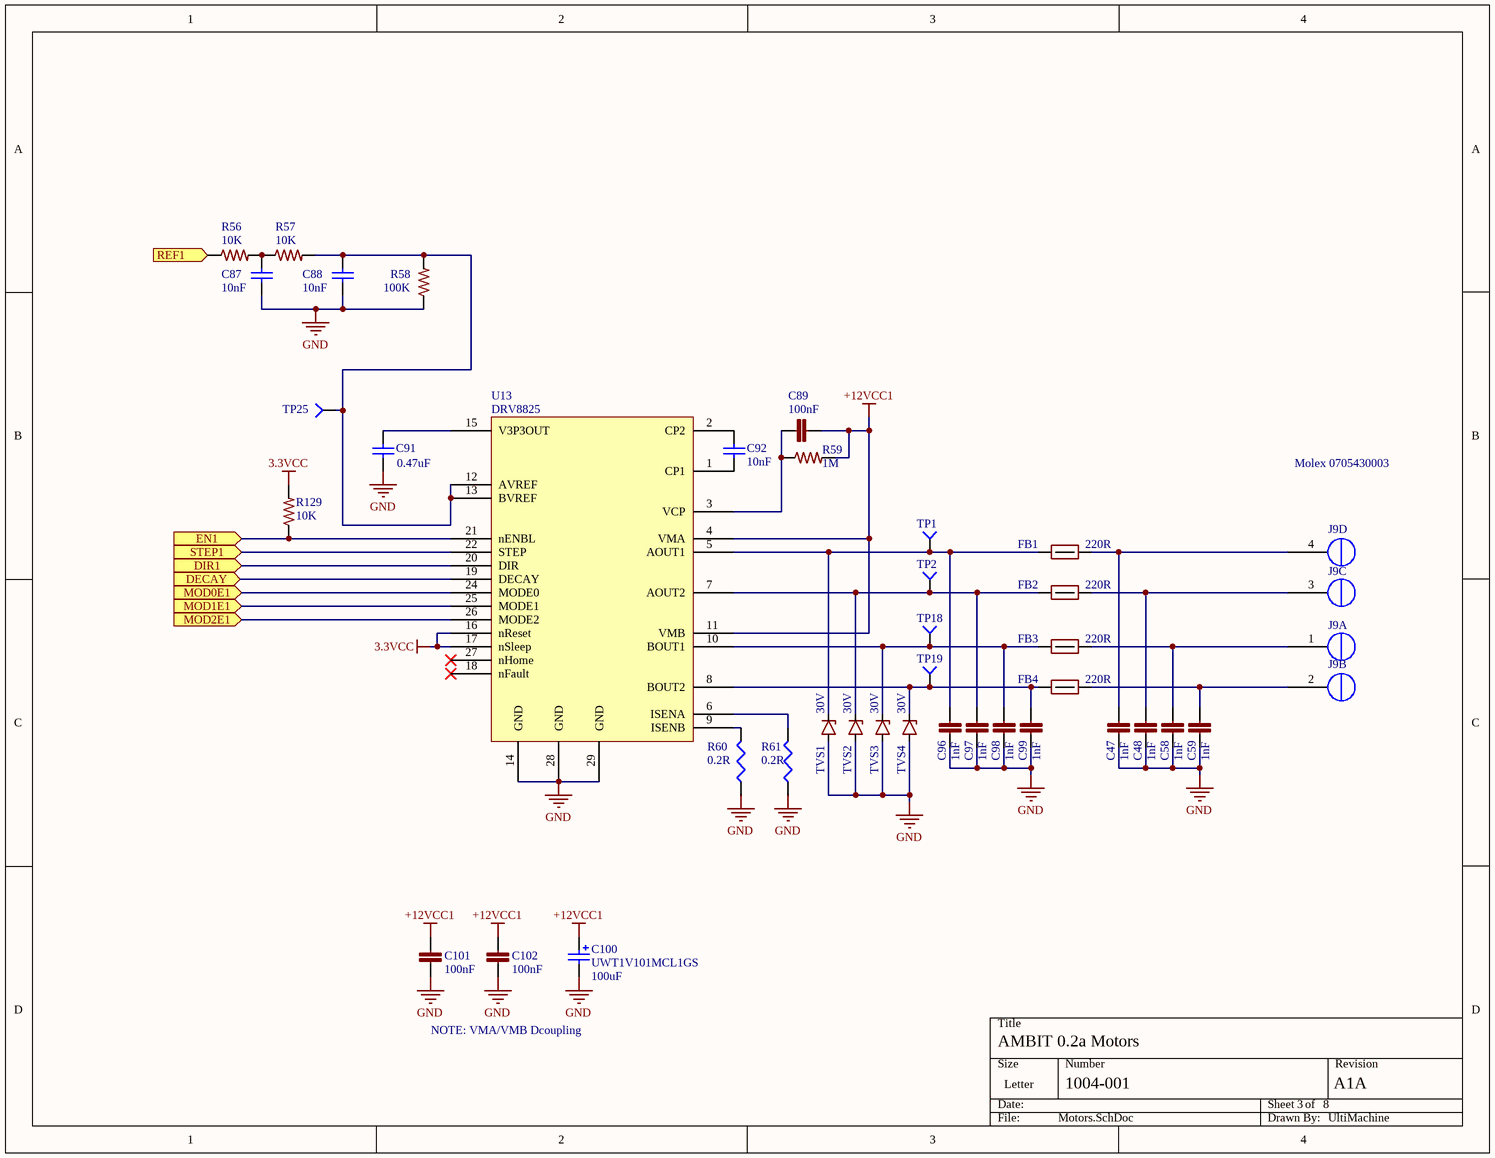
[diagram p4: Motors.SchDoc]

### Parts
(Parts that share a designator on the sheet are numbered #1, #2 ... from top to bottom, then left to right.)
C47  1nF  [C0402]
C48  1nF  [C0402]
C58  1nF  [C0402]
C59  1nF  [C0402]
C87  10nF  [C0402]
C88  10nF  [C0402]
C89  100nF  [C0402]
C91  value 0.47uF  [C0402]  (hidden comment: 0402)
C92  10nF  [C0402]
C96  1nF  [C0402]
C97  1nF  [C0402]
C98  1nF  [C0402]
C99  1nF  [C0402]
C100  UWT1V101MCL1GS  value 100uF  [CAP-ELEC-063063077]
C101  100nF  [C0603]
C102  100nF  [C0603]
FB1  220R  [FB0603]
FB2  220R  [FB0603]
FB3  220R  [FB0603]
FB4  220R  [FB0603]
J9#2  Molex 0705430003  [4POL254]  (parts A,B,C,D of 4)
R56  10K  [R0402]
R57  10K  [R0402]
R58  100K  [R0402]
R59  1M  [R0402]
R60  value 0.2R  [2512R-0.55]  (hidden comment: 2512)
R61#2  value 0.2R  [2512R-0.55]  (hidden comment: 2512)
R129#1  10K  [R0402]
TP1  TP4  [TP-2]  (value not drawn)
TP2  TP4  [TP-2]  (value not drawn)
TP18  TP4  [TP-2]  (value not drawn)
TP19  TP4  [TP-2]  (value not drawn)
TP25#2  TP4  [TP-2]  (value not drawn)
TVS1  value 30V  [SMF]  (hidden comment: TVS 30V SMF)
TVS2  value 30V  [SMF]  (hidden comment: TVS 30V SMF)
TVS3  value 30V  [SMF]  (hidden comment: TVS 30V SMF)
TVS4  value 30V  [SMF]  (hidden comment: TVS 30V SMF)
U13  DRV8825  [DRV8825PWPR]

### Ports
DECAY, DIR1, EN1, MOD0E1, MOD1E1, MOD2E1, REF1, STEP1

### Nets
3.3VCC: R129#1.2 U13.16(nReset) U13.17(nSleep)
+12VCC1: C89.2 C100.1 C101.1 C102.1 R59.2 U13.4(VMA) U13.11(VMB)
GND: C47.2 C48.2 C58.2 C59.2 C87.1 C88.1 C91.1 C96.2 C97.2 C98.2 C99.2 C100.2 C101.2 C102.2 R58.1 R60.1 R61#2.1 TVS1.A TVS2.A TVS3.A TVS4.A U13.14(GND) U13.28(GND) U13.29(GND)
NetC47_1: C47.1 FB1.2 J9#2.4(OUT1B)
NetC48_1: C48.1 FB2.2 J9#2.3(OUT1A)
NetC58_1: C58.1 FB3.2 J9#2.1(OUT2B)
NetC59_1: C59.1 FB4.2 J9#2.2(OUT2A)
NetC87_2: C87.2 R56.2 R57.1
NetC88_2: C88.2 R57.2 R58.2 TP25#2.1 U13.12(AVREF) U13.13(BVREF)
NetC89_1: C89.1 R59.1 U13.3(VCP)
NetC91_2: C91.2 U13.15(V3P3OUT)
NetC92_1: C92.1 U13.1(CP1)
NetC92_2: C92.2 U13.2(CP2)
NetC96_1: C96.1 FB1.1 TP1.1 TVS1.K U13.5(AOUT1)
NetC97_1: C97.1 FB2.1 TP2.1 TVS2.K U13.7(AOUT2)
NetC98_1: C98.1 FB3.1 TP18.1 TVS3.K U13.10(BOUT1)
NetC99_1: C99.1 FB4.1 TP19.1 TVS4.K U13.8(BOUT2)
NetR56_1: R56.1 ; port REF1
NetR60_2: R60.2 U13.9(ISENB)
NetR61#2_2: R61#2.2 U13.6(ISENA)
NetR129#1_1: R129#1.1 U13.21(nENBL) ; port EN1
NetU13_19: U13.19(DECAY) ; port DECAY
NetU13_20: U13.20(DIR) ; port DIR1
NetU13_22: U13.22(STEP) ; port STEP1
NetU13_24: U13.24(MODE0) ; port MOD0E1
NetU13_25: U13.25(MODE1) ; port MOD1E1
NetU13_26: U13.26(MODE2) ; port MOD2E1

Not connected (* = marked no-connect by the designer): U13 18(nFault)* 23(NC) 27(nHome)*

### Notes on the sheet
- NOTE: VMA/VMB Dcoupling

### Library data of the parts
C47 C48 C58 C59 C96-C99 = CAP 1nF 50V 0402 X7R: 1000pF 50V Ceramic Capacitor X7R 0402 (1005 Metric) 0.039" L x 0.020" W (1.00mm x 0.50mm); ManufacturerPartNumber: GRM155R71H102KA01D; LastRevisionNote: ImportComponents; Published: 23-Apr-2014; Publisher: UltiMachine; LastRevisionDate: 23-Apr-2014; VALUE: 1nF
C87 C88 C92 = GRM155R71H103JA88D: CAP CER 10nF 50V X7R 0402; MFR: Murata; Part Description: CAP CER 10000PF 50V X7R 0402; Tolerance: 10%; Voltage: 6.3VDC; Value: 0.01uF 50V; Published: 10 - Dec - 2014; LatestRevisionDate: 10 - Dec - 2014; LatestRevisionNote: Ultimachine Footprint Added; Publisher: Ultimachine; Component Type: Chip Capacitor; MFR Part #: GRM155R71H103JA88D; Mounting Type: SMT 0402; Datasheet: http://search.murata.co.jp/Ceramy/image/img/A01X/G101/ENG/GRM155R71H103JA88-01.pdf; Height: 0.5 ±0.05mm; Digikey #: 490-7763-1-ND; PackageReference: 0402
C89 = GRM155R71C104KA88D: CAP CER 0402 100nF 16V 10% X7R; LastRevisionNote: ImportComponents; Published: 23-Apr-2014; Publisher: UltiMachine; LastRevisionDate: 23-Apr-2014; ManufacturerPartNumber: GRM155R71C104KA88D; VALUE: 100nF
C91 = GRM155R60J474KE19D: 0.47uF 6.3v C0402 - GRM155R60J474KE19D; MFR: Murata; Part Description: CAP CER 0.47UF 6.3V 10% X5R 0402; Tolerance: 10%; Voltage: 6.3VDC; Published: 10 - Dec - 2014; LatestRevisionDate: 10 - Dec - 2014; LatestRevisionNote: Ultimachine Footprint Added; Publisher: Ultimachine; Component Type: Chip Capacitor; MFR Part #: GRM155R60J474KE19D; Mounting Type: SMT 0402; Datasheet: http://search.murata.co.jp/Ceramy/image/img/A01X/G101/ENG/GRM155R60J474KE19-01.pdf; Height: 0.5 ±0.05mm; PackageReference: 0402
C100 = UWT1V101MCL1GS: CAP ALUM 100UF 35V 20% SMD; Status: Active; Height: 7.70mm; Manufacture Part #: UWT1V101MCL1GS
C101 C102 = C0603C104K5RACTU: CAP CER 0603 100nF 50V 10% X7R; LastRevisionNote: ImportComponents; Published: 23-Apr-2014; Publisher: UltiMachine; LastRevisionDate: 23-Apr-2014; ManufacturerPartNumber: C0603C104K5RACTU; VALUE: 100nF
FB1-FB4 = FERRITE 220R 2.5A 0603: FERRITE BEAD 220 OHM 0603 1LN; Manufacturer: Samsung; ManufacturerPartNumber: CIS10P221NC; LastRevisionNote: ImportComponents; Published: 23-Apr-2014; Publisher: UltiMachine; LastRevisionDate: 23-Apr-2014; Value: 220R
J9#2 = Molex 0705430003 Alt: Molex 4 Pin Clip Connector
R56 R57 R129#1 = RC0402FR-0710KP: RES SMD 10K OHM 1% 1/16W 0402; LastRevisionNote: ImportComponents; Published: 23-Apr-2014; Publisher: UltiMachine; LastRevisionDate: 23-Apr-2014; ManufacturerPartNumber: RC0402FR-0710KP; VALUE: 10K
R58 = RC1005F104CS: RES SMD 100K OHM 1% 1/16W 0402; Manufacturer: Samsung; LastRevisionNote: ImportComponents; Digilkey #: 1276-3432-1-ND; Published: 23-Apr-2014; Publisher: UltiMachine; LastRevisionDate: 23-Apr-2014; ManufacturerPartNumber: RC1005F104CS; VALUE: 100K
R59 = ERJ2GEJ105X: RES 0402 1M 100mW 5%; LastRevisionNote: ImportComponents; Published: 23-Apr-2014; Publisher: UltiMachine; LastRevisionDate: 23-Apr-2014; ManufacturerPartNumber: ERJ2GEJ105X; VALUE: 1M
R60 R61#2 = CSRN2512FTR200: RES SMD 0.2 OHM 1% 2W 2512; MFR: Stackpole ELectronics Inc; MFR #: CSRN2512FTR100; PackageReference: 2512; Digikey #: CSRN2512FTR100TR-ND; PDF: http://www.seielect.com/catalog/SEI-CSR_CSRN.pdf
TP1 TP2 TP18 TP19 TP25#2 = Socket: LatestRevisionDate: 17-Jul-2002; LatestRevisionNote: Re-released for DXP Platform.; Publisher: Altium Limited
TVS1-TVS4 = TVS 30V SMF: TVS DIODE 30VWM 48.4VC SMF; ManufacturerPartNumber: SMF30A-E3-08; LastRevisionNote: ImportComponents; Published: 23-Apr-2014; Publisher: UltiMachine; LastRevisionDate: 23-Apr-2014
U13 = DRV8825: DRV8825 Ti Stepper Driver; Manufacture: Texas Instruments; Mountining Type: SMD - Ti PowerPAD Package; Voltage: 8.2-45VDC; Cost (1000 qty): 2.25; Part Number: DRV8825PWPR; Status: In-Production; Pins: 28 Pins and one Exposed Pad; Datasheet: http://www.ti.com/lit/gpn/drv8825; Height: 1.2mm; Tolerance: N/A; Type: Stepper Driver - Integrated Circuit; Lead Free: YES

## Sheet Motor-Z.SchDoc: Motor-Z
size Letter; DocumentNumber: 4; SheetNumber: 7; SheetTotal: 11
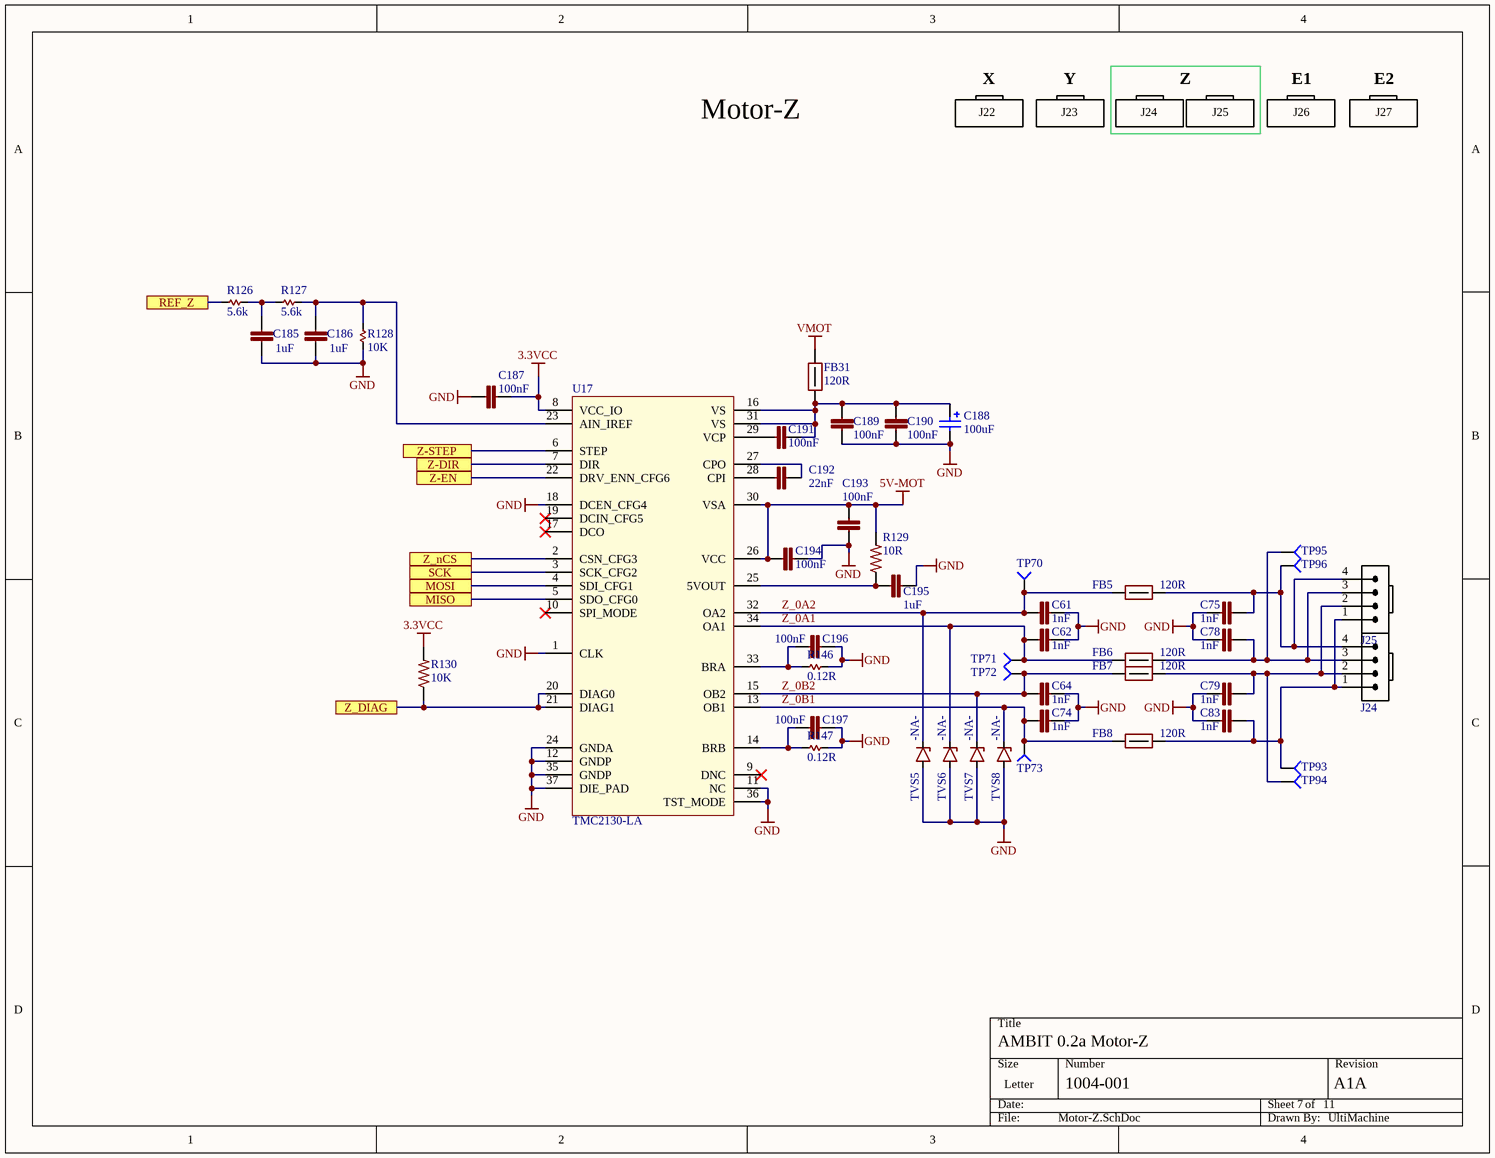
[diagram p5: Motor-Z.SchDoc]

### Parts
(Parts that share a designator on the sheet are numbered #1, #2 ... from top to bottom, then left to right.)
C61  1nF  [C0402]
C62  1nF  [C0402]
C64  1nF  [C0402]
C74  1nF  [C0402]
C75  1nF  [C0402]
C78  1nF  [C0402]
C79  1nF  [C0402]
C83  1nF  [C0402]
C185  1uF  [C0402]
C186  1uF  [C0402]
C187  100nF  [C0402]
C188  value 100uF  [CAP-ELEC-063063077]  (hidden comment: UWT1V101MCL1GS)
C189  100nF  [C0603]
C190  100nF  [C0603]
C191  100nF  [C0603]
C192  22nF  [C0402]
C193  100nF  [C0402]
C194  100nF  [C0402]
C195  1uF  [C0402]
C196  100nF  [C0603]
C197  100nF  [C0603]
FB5  120R  [FB0603]
FB6  120R  [FB0603]
FB7  120R  [FB0603]
FB8  120R  [FB0603]
FB31  120R  [FB0603]
J24  Molex 0705430038  [4POL254 PIN-IN-PASTE]  (value not drawn)
J25  Molex 0705430038  [4POL254 PIN-IN-PASTE]  (value not drawn)
R126  5.6k  [R0402]
R127  5.6k  [R0402]
R128  10K  [R0402]
R129#2  10R  [R0402]
R130  10K  [R0402]
R146  0.12R  [R1206]
R147  0.12R  [R1206]
TP70  TP4  [TP-2]  (value not drawn)  (no BOM)
TP71  TP4  [TP-2]  (value not drawn)  (no BOM)
TP72  TP4  [TP-2]  (value not drawn)  (no BOM)
TP73  TP4  [TP-2]  (value not drawn)  (no BOM)
TP93  TP4  [TP-2]  (value not drawn)  (no BOM)
TP94  TP4  [TP-2]  (value not drawn)  (no BOM)
TP95  TP4  [TP-2]  (value not drawn)  (no BOM)
TP96  TP4  [TP-2]  (value not drawn)  (no BOM)
TVS5  value -NA-  [SMF]  (hidden comment: TVS 30V SMF)
TVS6  value -NA-  [SMF]  (hidden comment: TVS 30V SMF)
TVS7  value -NA-  [SMF]  (hidden comment: TVS 30V SMF)
TVS8  value -NA-  [SMF]  (hidden comment: TVS 30V SMF)
U17  TMC2130-LA  [QFN36-50P500X600X900_HS-37N]

### Ports
MISO, MOSI, REF_Z, SCK, Z-DIR, Z-EN, Z-STEP, Z_DIAG, Z_nCS

### Nets
3.3VCC: C187.1 R130.2 U17.8(VCC_IO)
5V-MOT: C193.2 C194.2 R129#2.2 U17.26(VCC) U17.30(VSA)
GND: C61.2 C62.2 C64.2 C74.2 C75.1 C78.1 C79.1 C83.1 C185.2 C186.2 C187.2 C188.2 C189.1 C190.1 C193.1 C194.1 C195.2 C196.1 C197.1 R128.1 R146.2 R147.2 TVS5.A TVS6.A TVS7.A TVS8.A U17.1(CLK) U17.11(NC) U17.12(GNDP) U17.18(DCEN_CFG4) U17.24(GNDA) U17.35(GNDP) U17.36(TST_MODE) U17.37(DIE_PAD)
VMOT: FB31.2
Z_0A1: C62.1 FB6.1 TP71.1 TVS6.K U17.34(OA1)
Z_0A2: C61.1 FB5.1 TP70.1 TVS5.K U17.32(OA2)
Z_0B1: C74.1 FB8.1 TP73.1 TVS8.K U17.13(OB1)
Z_0B2: C64.1 FB7.1 TP72.1 TVS7.K U17.15(OB2)
NetC75_2: C75.2 FB5.2 J24.4 J25.4 TP96.1
NetC78_2: C78.2 FB6.2 J24.3 J25.3 TP95.1
NetC79_2: C79.2 FB7.2 J24.2 J25.2 TP94.1
NetC83_2: C83.2 FB8.2 J24.1 J25.1 TP93.1
NetC185_1: C185.1 R126.2 R127.1
NetC186_1: C186.1 R127.2 R128.2 U17.23(AIN_IREF)
NetC188_1: C188.1 C189.2 C190.2 C191.2 FB31.1 U17.16(VS) U17.31(VS)
NetC191_1: C191.1 U17.29(VCP)
NetC192_1: C192.1 U17.28(CPI)
NetC192_2: C192.2 U17.27(CPO)
NetC195_1: C195.1 R129#2.1 U17.25(5VOUT)
NetC196_2: C196.2 R146.1 U17.33(BRA)
NetC197_2: C197.2 R147.1 U17.14(BRB)
NetR101_1: R126.1 ; port REF_Z
NetR130_1: R130.1 U17.20(DIAG0) U17.21(DIAG1) ; port Z_DIAG
NetU11#2_14: U17.5(SDO_CFG0) ; port MISO
NetU11#2_15: U17.3(SCK_CFG2) ; port SCK
NetU11#2_16: U17.4(SDI_CFG1) ; port MOSI
NetU11#2_98: U17.7(DIR) ; port Z-DIR
NetU11#2_99: U17.6(STEP) ; port Z-STEP
NetU11#2_100: U17.2(CSN_CFG3) ; port Z_nCS
NetU11#2_101: U17.22(DRV_ENN_CFG6) ; port Z-EN

Not connected (* = marked no-connect by the designer): U17 9(DNC)* 10(SPI_MODE)* 17(DCO)* 19(DCIN_CFG5)*

### Notes on the sheet
- X
- Y
- Z
- E1
- E2
- Motor-Z
- J22
- J23
- J24
- J25
- J26
- J27

### Library data of the parts
C61 C62 C64 C74 C75 C78 C79 C83 = CAP 1nF 50V 0402 X7R: 1000pF 50V Ceramic Capacitor X7R 0402 (1005 Metric) 0.039" L x 0.020" W (1.00mm x 0.50mm); MANUFACTURER: Murata; MANUFACTURER #: GRM155R71H102KA01D; PART: 1nF 50V X7R 0402; PART DESCRIPTION: 1000pF ±10% 50V Ceramic Capacitor X7R 0402 (1005 Metric); TOLERANCE: 10%; VALUE: 1nF; DISTRIBUTOR #: 490-1303-2-ND; DISTRIBUTOR: Digi-Key Electronics; EE_SPEC: 50V
C185 C186 = GRM155R60J105KE19D: CAP CER 0402 1uF 6.3V 10% X5R; MANUFACTURER: Murata; PART: 1uF 6.3V X5R 0402; PART DESCRIPTION: 1µF ±10% 6.3V Ceramic Capacitor X5R 0402 (1005 Metric); VALUE: 1uF; MANUFACTURER #: GRM155R60J105KE19D; DISTRIBUTOR #: 490-1320-2-ND; DISTRIBUTOR: Digi-Key Electronics; TOLERANCE: 10%; EE_SPEC: 1uF 6.3V X5R 0402
C187 C193 C194 = GRM155R71C104KA88D: CAP CER 0402 100nF 16V 10% X7R; Manufacturer: Murata; PART: 0.1uF 16V X7R 0402; Part Description: 0.10µF ±10% 16V Ceramic Capacitor X7R 0402 (1005 Metric); EE_SPEC: 100nF 16V X7R 0402; VALUE: 100nF; MANUFACTURER #: GRM155R71C104KA88D; DISTRIBUTOR #: 490-3261-2-ND; DISTRIBUTOR: Digi-Key Electronics; Tolerance: 10%
C188 = UWT1V101MCL1GS: CAP ALUM 100UF 35V 20% SMD; Manufacturer: Nichicon; PART: 100uF 35V SMD Al-El; Part Description: 100µF 35V Aluminum Capacitors Radial, Can - SMD 1000 Hrs @ 105°C; EE_SPEC: 100uF 35V Al-El; MANUFACTURER #: UWT1V101MCL1GS; DISTRIBUTOR #: 493-2203-2-ND; DISTRIBUTOR: Digi-Key Electronics; Tolerance: 20%
C189-C191 C196 C197 = C0603C104K5RACTU: CAP CER 0603 100nF 50V 10% X7R; Manufacturer: Kemet; Part Description: 0.1µF ±10% 50V Ceramic Capacitor X7R 0603 (1608 Metric); EE_SPEC: 100nF 50V X7R 0603; VALUE: 100nF; MANUFACTURER #: C0603C104K5RACTU; DISTRIBUTOR #: 399-5089-2-ND; DISTRIBUTOR: Digi-Key Electronics; PART: 100nF 50V X7R 0603; Tolerance: 10%
C192 = GCM155R71H223KA55D: CAP CER 0402 22nF ±10% 50V X7R; Manufacturer: YAGEO; Part Description: 0.022µF ±10% 50V Ceramic Capacitor X7R 0402 (1005 Metric); EE_SPEC: 22nF 50V X7R 0402; Tolerance: +/- 10%; VALUE: 22nF; MANUFACTURER #: GCM155R71H223KA55D; DISTRIBUTOR #: 490-4763-2-ND; DISTRIBUTOR: Digi-Key Electronics; PART: 22nF
C195 = GRM155R60J105KE19D: CAP CER 0402 1uF 6.3V 10% X5R; Manufacturer: Murata; Part Description: 1µF ±10% 6.3V Ceramic Capacitor X5R 0402 (1005 Metric); EE_SPEC: 1uF 6.3V X5R 0402; VALUE: 1uF; MANUFACTURER #: GRM155R60J105KE19D; DISTRIBUTOR #: 490-1320-2-ND; DISTRIBUTOR: Digi-Key Electronics; PART: 1uF 6.3V X5R 0402; Tolerance: 10%
FB5-FB8 = FERRITE 120R 3A 0603: FERRITE BEAD 120 OHM 0603 1LN; MANUFACTURER: Samsung; MANUFACTURER #: CIS10P121AC; MANUFACTURER2#: 490-5254-2-ND; VALUE: 120Rfb; TOLERANCE: -NA-; EE_SPEC: 3A; DISTRIBUTOR #: 1276-6351-2-ND; DISTRIBUTOR: Digi-Key Electronics; PART: FERRITE 120R 3A 0603; PART DESCRIPTION: FERRITE BEAD 120 OHM 0603 1LN
FB31 = FERRITE 120R 3A 0603: FERRITE BEAD 120 OHM 0603 1LN; MANUFACTURER: Samsung; MANUFACTURER #: CIS10P121AC; VALUE: 120Rfb; TOLERANCE: -NA-; EE_SPEC: 3A; DISTRIBUTOR #: 1276-6351-2-ND; DISTRIBUTOR: Digi-Key Electronics; PART: FERRITE 120R 3A 0603; PART DESCRIPTION: FERRITE BEAD 120 OHM 0603 1LN
J24 J25 = Molex 0705430003 PIP: Molex 4 Pin Clip Connector - Pin In Paste footprint
R126 R127 = 5.6k 1% 0402: RES SMD 5.6K OHM 1% 1/16W 0402; MANUFACTURER: YAGEO; MANUFACTURER #: RC0402FR-075K6L; PART DESCRIPTION: ±1% 0.063W, 1/16W Chip Resistor 0402 (1005 Metric) Moisture Resistant Thick Film; DISTRIBUTOR #: 311-5.6KLRTR-ND; DISTRIBUTOR: Digi-Key Electronics; PART: RES SMD 5.6K OHM 1% 1/16W 0402; TOLERANCE: 1%; EE_SPEC: 1/16W; VALUE: 5.6k
R128 = 10k 1% 0402: RES SMD 10K OHM 1% 1/16W 0402; MANUFACTURER: Yageo; MANUFACTURER #: RC0402FR-0710KP; PART DESCRIPTION: 10k Ohm ±1% 0.063W, 1/16W Chip Resistor 0402 (1005 Metric) Moisture Resistant Thick Film; DISTRIBUTOR #: YAG1249TR-ND; DISTRIBUTOR: Digi-Key Electronics; PART: 10k 1% 0402; TOLERANCE: 1%; EE_SPEC: 1/16W; VALUE: 10K
R129#2 = RC0402FR-0710RL: RES SMD 10 OHM 1% 1/16W 0402; Manufacturer: Yageo; Part Description: 10 Ohm ±1% 0.063W, 1/16W Chip Resistor 0402 (1005 Metric) Moisture Resistant Thick Film; EE_SPEC: 10R 1% 0402; VALUE: 10R; MANUFACTURER #: RC0402FR-0710RL; DISTRIBUTOR #: 311-10.0LRTR-ND; DISTRIBUTOR: Digi-Key Electronics; PART: 10R; Tolerance: 1%
R130 = RC0402FR-0710KP: RES SMD 10K OHM 1% 1/16W 0402; MANUFACTURER: Yageo; PART: 10k 1% 0402; PART DESCRIPTION: 10k Ohm ±1% 0.063W, 1/16W Chip Resistor 0402 (1005 Metric) Moisture Resistant Thick Film; VALUE: 10K; MANUFACTURER #: RC0402FR-0710KP; DISTRIBUTOR #: YAG1249TR-ND; DISTRIBUTOR: Digi-Key Electronics; TOLERANCE: 1%; EE_SPEC: 1/16W
R146 R147 = 0.12R 1% 1206: RES 0.12 OHM 1% 1/2W 1206; MANUFACTURER #: RL1206FR-7W0R12L; Part Description: 120 mOhms ±1% 0.5W, 1/2W Chip Resistor 1206 (3216 Metric) Automotive AEC-Q200, Current Sense, Moisture Resistant Thick Film; Tolerance: +/- 1%; DISTRIBUTOR #: 311-.12LYTR-ND; DISTRIBUTOR: Digi-Key; EE_SPEC: 0.12R 1% 1206; PART: 0.12R; VALUE: 0.12R
TP70-TP73 TP93-TP96 = Socket: MANUFACTURER #: NOTAPART-Testpoint
TVS5-TVS8 = TVS 30V SMF: TVS DIODE 30VWM 48.4VC SMF; MANUFACTURER: Vishay; MANUFACTURER #: SMF30A-E3-08; PART: TVS Diode 48.4VC; EE_SPEC: 30Vrs 48.4Vc; DISTRIBUTOR #: SMF30A-E3-08GITR-ND; DISTRIBUTOR: Digi-Key Electronics; PART DESCRIPTION: TVS DIODE 30VWM 48.4VC SMF; TOLERANCE: -NA-
U17 = TMC2130-LA-T: IC STEPPER MOTOR DVR SPI 36QFN; Manufacturer: Trinamic; Part Description: Bipolar Motor Driver Power MOSFET SPI, Step/Direction 36-QFN (5x6); EE_SPEC: 46V 1.2A 1/256 Step; Tolerance: NA; DISTRIBUTOR #: 1460-1130-2-ND; DISTRIBUTOR: Digi-Key Electronics; MANUFACTURER #: TMC2130-LA-T; PART: TMC2130; VALUE: TMC2130

## Sheet Thermistors.SchDoc: Thermistors
size Letter; DocumentNumber: 6; SheetNumber: 10; SheetTotal: 11
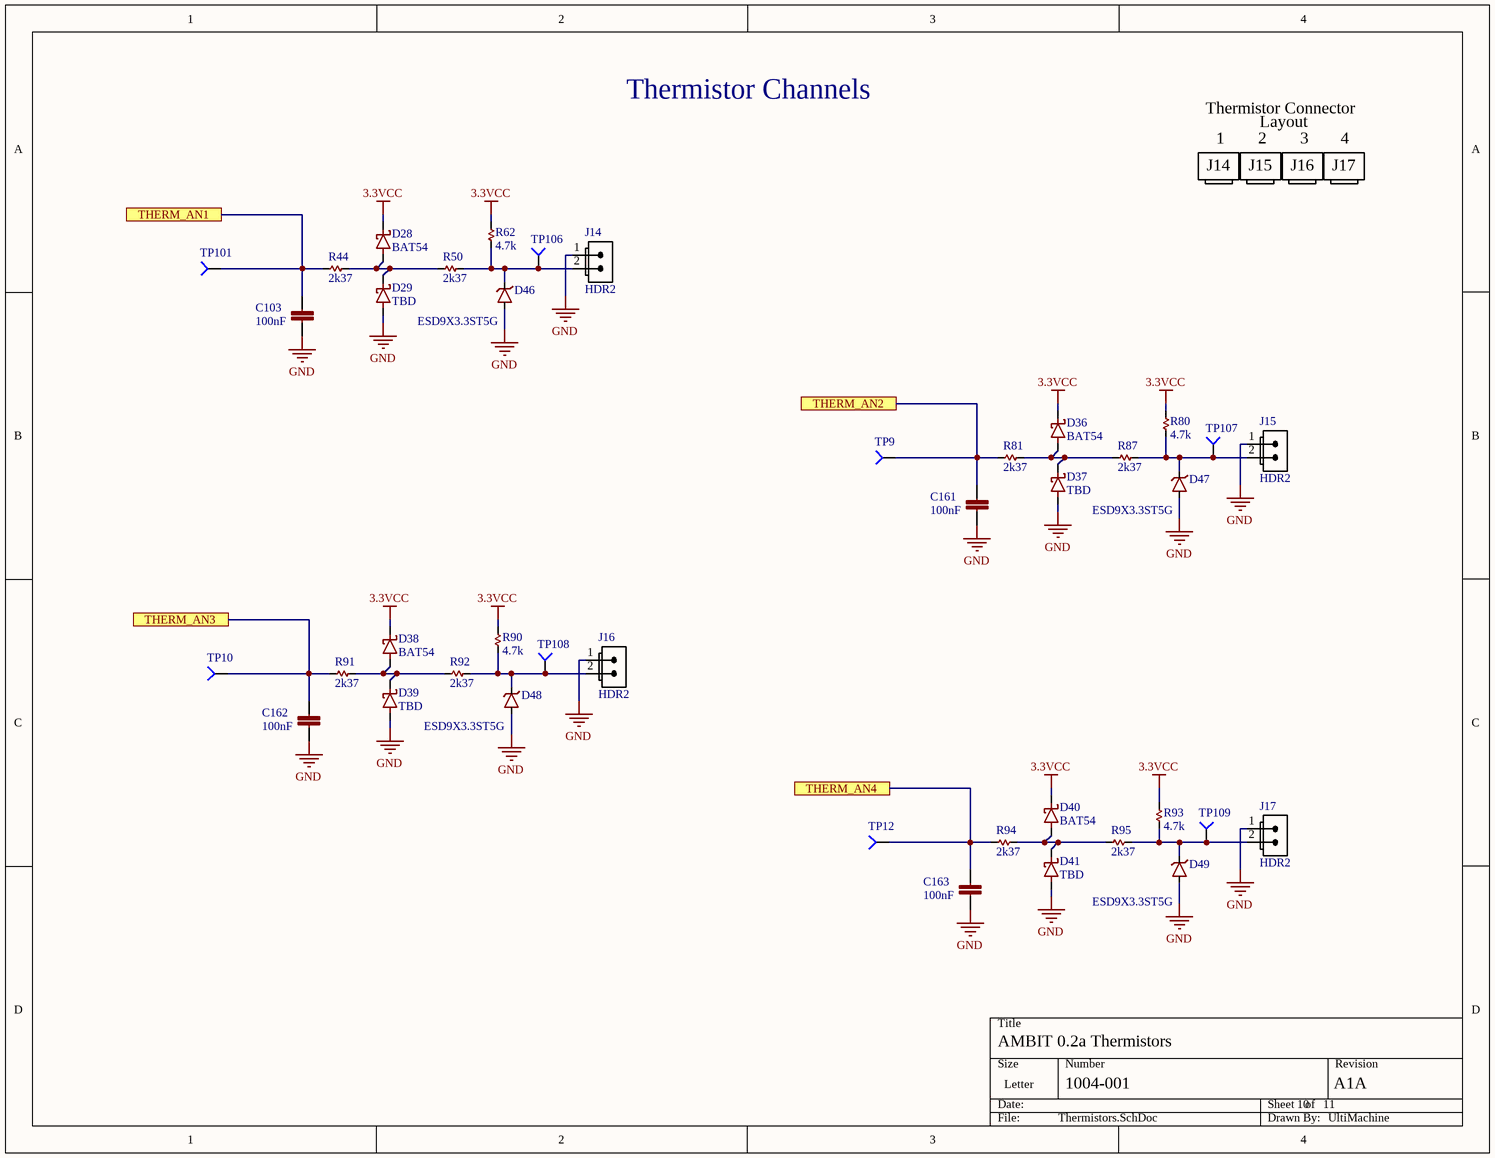
[diagram p6: Thermistors.SchDoc]

### Parts
C103  100nF  [C0402]
C161  100nF  [C0402]
C162  100nF  [C0402]
C163  100nF  [C0402]
D28  BAT54  [SOD523_IPC]
D29  TBD  [SOD523_IPC]
D36  BAT54  [SOD523_IPC]
D37  TBD  [SOD523_IPC]
D38  BAT54  [SOD523_IPC]
D39  TBD  [SOD523_IPC]
D40  BAT54  [SOD523_IPC]
D41  TBD  [SOD523_IPC]
D46  ESD9X3.3ST5G  [SOD923-D]
D47  ESD9X3.3ST5G  [SOD923-D]
D48  ESD9X3.3ST5G  [SOD923-D]
D49  ESD9X3.3ST5G  [SOD923-D]
J14  value HDR2  [70543-01 PIN-IN-PASTE]  (hidden comment: CONN 2PIN VERT 0.1" SHRD LOCKING PIP)
J15  value HDR2  [70543-01 PIN-IN-PASTE]  (hidden comment: CONN 2PIN VERT 0.1" SHRD LOCKING PIP)
J16  value HDR2  [70543-01 PIN-IN-PASTE]  (hidden comment: CONN 2PIN VERT 0.1" SHRD LOCKING PIP)
J17  value HDR2  [70543-01 PIN-IN-PASTE]  (hidden comment: CONN 2PIN VERT 0.1" SHRD LOCKING PIP)
R44  2k37  [R0402]
R50  2k37  [R0402]
R62  4.7k  [R0402]
R80  4.7k  [R0402]
R81  2k37  [R0402]
R87  2k37  [R0402]
R90  4.7k  [R0402]
R91  2k37  [R0402]
R92  2k37  [R0402]
R93  4.7k  [R0402]
R94  2k37  [R0402]
R95  2k37  [R0402]
TP9  TP4  [TP-2]  (value not drawn)  (no BOM)
TP10  TP4  [TP-2]  (value not drawn)  (no BOM)
TP12  TP4  [TP-2]  (value not drawn)  (no BOM)
TP101  TP4  [TP-2]  (value not drawn)  (no BOM)
TP106  TP4  [TP-2]  (value not drawn)  (no BOM)
TP107  TP4  [TP-2]  (value not drawn)  (no BOM)
TP108  TP4  [TP-2]  (value not drawn)  (no BOM)
TP109  TP4  [TP-2]  (value not drawn)  (no BOM)

### Ports
THERM_AN1, THERM_AN2, THERM_AN3, THERM_AN4

### Nets
3.3VCC: D28.K D36.K D38.K D40.K R62.2 R80.2 R90.2 R93.2
GND: C103.2 C161.2 C162.2 C163.2 D29.A D37.A D39.A D41.A D46.A D47.A D48.A D49.A J14.1(S) J15.1(S) J16.1(S) J17.1(S)
THERM_AN1: C103.1 R44.1 TP101.1 ; port THERM_AN1
THERM_AN2: C161.1 R81.1 TP9.1 ; port THERM_AN2
THERM_AN3: C162.1 R91.1 TP10.1 ; port THERM_AN3
THERM_AN4: C163.1 R94.1 TP12.1 ; port THERM_AN4
NetD28_A: D28.A D29.K R44.2 R50.1
NetD36_A: D36.A D37.K R81.2 R87.1
NetD38_A: D38.A D39.K R91.2 R92.1
NetD40_A: D40.A D41.K R94.2 R95.1
NetD46_K: D46.K J14.2(S) R50.2 R62.1 TP106.1
NetD47_K: D47.K J15.2(S) R80.1 R87.2 TP107.1
NetD48_K: D48.K J16.2(S) R90.1 R92.2 TP108.1
NetD49_K: D49.K J17.2(S) R93.1 R95.2 TP109.1

### Notes on the sheet
- Thermistor Channels
- Thermistor Connector
- 1
- 2
- Layout
- 3
- 4
- J14
- J15
- J16
- J17

### Library data of the parts
C103 C161-C163 = GRM155R71C104KA88D: CAP CER 0402 100nF 16V 10% X7R; MANUFACTURER: Murata; PART: 0.1uF 16V X7R 0402; PART DESCRIPTION: 0.10µF ±10% 16V Ceramic Capacitor X7R 0402 (1005 Metric); EE_SPEC: 100nF 16V X7R 0402; VALUE: 100nF; MANUFACTURER #: GRM155R71C104KA88D; DISTRIBUTOR #: 490-3261-2-ND; DISTRIBUTOR: Digi-Key Electronics; TOLERANCE: 10%
D28 D36 D38 D40 = BAT54WX: DIODE SCHOTTKY 30V 200MA SOD523; MANUFACTURER: Diodes Incorporated; MANUFACTURER #: BAT54WX-TP; PART: Schottky Diode; PART DESCRIPTION: Diode Schottky 30V 200mA (DC) Surface Mount SOD-523; TOLERANCE: -NA-; VALUE: BAT54; DISTRIBUTOR #: BAT54WX-TPTR-ND; DISTRIBUTOR: Digi-Key Electronics; EE_SPEC: 30V 200mA
D29 D37 D39 D41 = SOD523_TBD: TOLERANCE: -NA-; MANUFACTURER: TBD; VALUE: TBD; MANUFACTURER #: TBD; EE_SPEC: TBD
D46-D49 = ESD9X3.3ST5G: TVS DIODE 3.3VWM 10.4VC SOD923; MANUFACTURER: On Semi; PART DESCRIPTION: TVS DIODE 3.3VWM SOD923; TOLERANCE: -NA-; VALUE: 3.3V; EE_SPEC: 3.3Vso 15pF; MANUFACTURER #: ESD9X3.3ST5G; DISTRIBUTOR #: ESD9X3.3ST5GOSCT-ND; DISTRIBUTOR: Digikey
J14-J17 = CONN 2PIN VERT 0.1" SHRD LOCKING PIP: Connector 2pos - Pin in Paste; MANUFACTURER: Molex; MANUFACTURER #: 0705430001; PART: 2 Pin Conn; PART DESCRIPTION: 2 Positions Header, Shrouded Connector 0.100" (2.54mm) Through Hole Gold; TOLERANCE: -NA-; DISTRIBUTOR #: WM4800-ND; DISTRIBUTOR: Digikey; EE_SPEC: -NA-
R44 R50 R81 R87 R91 R92 R94 R95 = RC0402FR-072K37L: RES SMD 2.37K OHM 1% 1/16W 0402; MANUFACTURER: Yageo; PART: 2.37k 1% 0402; PART DESCRIPTION: 2.37k Ohm ±1% 0.063W, 1/16W Chip Resistor 0402 (1005 Metric) Moisture Resistant Thick Film; VALUE: 2k37; MANUFACTURER #: RC0402FR-072K37L; DISTRIBUTOR #: 311-2.37KLRTR-ND; DISTRIBUTOR: Digi-Key Electronics; TOLERANCE: 1%; EE_SPEC: 1/16W
R62 R80 R90 R93 = RC0402FR-074K7L: RES SMD 4.7K OHM 1% 1/16W 0402; MANUFACTURER: YAGEO; PART: 4.7k 1% 0402; PART DESCRIPTION: 4.7k Ohm ±1% 0.063W, 1/16W Chip Resistor 0402 (1005 Metric) Moisture Resistant Thick Film; VALUE: 4.7k; MANUFACTURER #: RC0402FR-074K7L; DISTRIBUTOR #: 311-4.7KLRTR-ND; DISTRIBUTOR: Digi-Key Electronics; TOLERANCE: 1%; EE_SPEC: 1/16W
TP9 TP10 TP12 TP101 TP106-TP109 = Socket: MANUFACTURER #: NOTAPART-Testpoint

## Sheet Mosfets.SchDoc: Mosfets
size Letter; DocumentNumber: 5; SheetNumber: 11; SheetTotal: 11
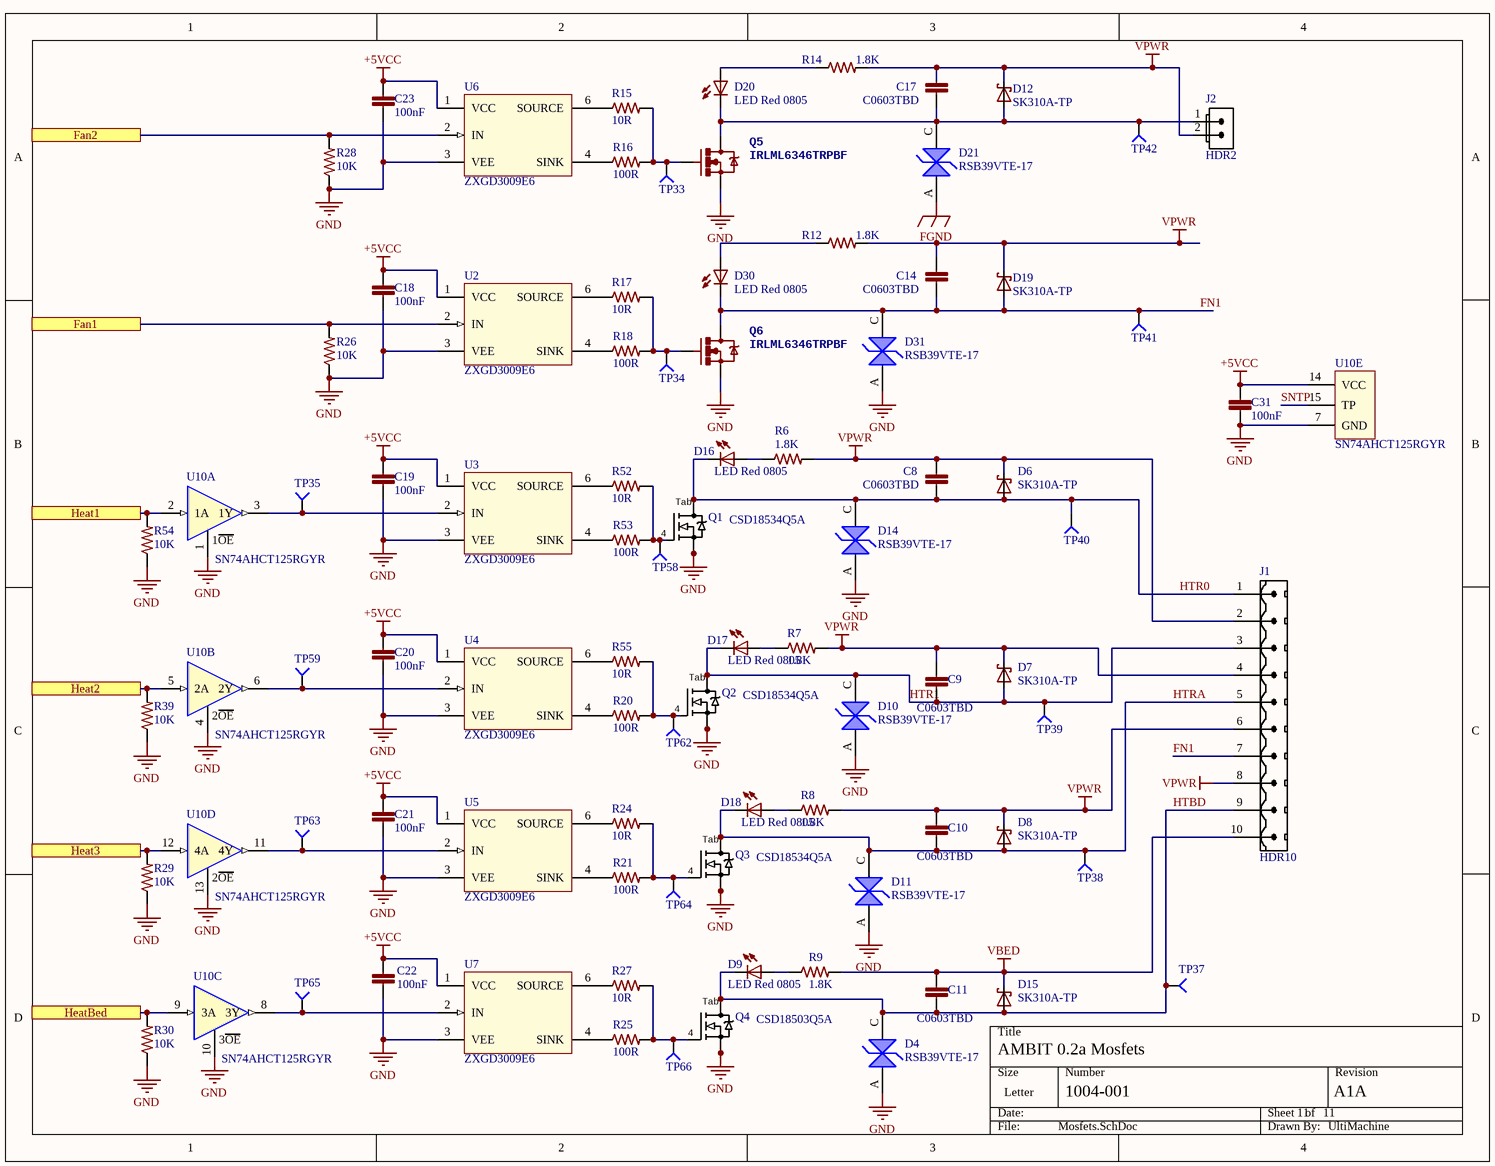
[diagram p7: Mosfets.SchDoc]

### Parts
C8  C0603TBD  [C0603]
C9  C0603TBD  [C0603]
C10  C0603TBD  [C0603]
C11  C0603TBD  [C0603]
C14  C0603TBD  [C0603]
C17  C0603TBD  [C0603]
C18  100nF  [C0402]
C19  100nF  [C0402]
C20  100nF  [C0402]
C21  100nF  [C0402]
C22  100nF  [C0402]
C23  100nF  [C0402]
C31  100nF  [C0402]
D4  RSB39VTE-17  [SOD323-R]
D6  SK310A-TP  [SMA-SM]
D7  SK310A-TP  [SMA-SM]
D8  SK310A-TP  [SMA-SM]
D9  PART: LED Red 0805  [LED2012120]  (hidden comment: Red)
D10  RSB39VTE-17  [SOD323-R]
D11  RSB39VTE-17  [SOD323-R]
D12  SK310A-TP  [SMA-SM]
D14  RSB39VTE-17  [SOD323-R]
D15  SK310A-TP  [SMA-SM]
D16  PART: LED Red 0805  [LED2012120]  (hidden comment: Red)
D17  PART: LED Red 0805  [LED2012120]  (hidden comment: Red)
D18  PART: LED Red 0805  [LED2012120]  (hidden comment: Red)
D19  SK310A-TP  [SMA-SM]
D20  PART: LED Red 0805  [LED2012120]  (hidden comment: Red)
D21  RSB39VTE-17  [SOD323-R]
D30  PART: LED Red 0805  [LED2012120]  (hidden comment: Red)
D31  RSB39VTE-17  [SOD323-R]
J1  value HDR10  [MSTBV10]  (hidden comment: Molex 0395311010)
J2  value HDR2  [70543-01 PIN-IN-PASTE]  (hidden comment: CONN 2PIN VERT 0.1" SHRD LOCKING PIP)
Q1  CSD18534Q5A  [SOT669_Universal]
Q2  CSD18534Q5A  [SOT669_Universal]
Q3  CSD18534Q5A  [SOT669_Universal]
Q4  CSD18503Q5A  [SOT669_Universal]
Q5  IRLML6346TRPBF  [SOT23-3]
Q6  IRLML6346TRPBF  [SOT23-3]
R6  1.8K  [R0603]
R7  1.8K  [R0603]
R8  1.8K  [R0603]
R9  1.8K  [R0603]
R12  1.8K  [R0603]
R14  1.8K  [R0603]
R15  10R  [R0402]
R16  100R  [R0402]
R17  10R  [R0402]
R18  100R  [R0402]
R20  100R  [R0402]
R21  100R  [R0402]
R24  10R  [R0402]
R25  100R  [R0402]
R26  10K  [R0402]
R27  10R  [R0402]
R28  10K  [R0402]
R29  10K  [R0402]
R30  10K  [R0402]
R39  10K  [R0402]
R52  10R  [R0402]
R53  100R  [R0402]
R54  10K  [R0402]
R55  10R  [R0402]
TP33  TP4  [TP-2]  (value not drawn)  (no BOM)
TP34  TP4  [TP-2]  (value not drawn)  (no BOM)
TP35  TP4  [TP-2]  (value not drawn)  (no BOM)
TP37  TP4  [TP-2]  (value not drawn)  (no BOM)
TP38  TP4  [TP-2]  (value not drawn)  (no BOM)
TP39  TP4  [TP-2]  (value not drawn)  (no BOM)
TP40  TP4  [TP-2]  (value not drawn)  (no BOM)
TP41  TP4  [TP-2]  (value not drawn)  (no BOM)
TP42  TP4  [TP-2]  (value not drawn)  (no BOM)
TP58  TP4  [TP-2]  (value not drawn)  (no BOM)
TP59  TP4  [TP-2]  (value not drawn)  (no BOM)
TP62  TP4  [TP-2]  (value not drawn)  (no BOM)
TP63  TP4  [TP-2]  (value not drawn)  (no BOM)
TP64  TP4  [TP-2]  (value not drawn)  (no BOM)
TP65  TP4  [TP-2]  (value not drawn)  (no BOM)
TP66  TP4  [TP-2]  (value not drawn)  (no BOM)
U2  ZXGD3009E6  [SOT26P285X140-6L]
U3  ZXGD3009E6  [SOT26P285X140-6L]
U4  ZXGD3009E6  [SOT26P285X140-6L]
U5  ZXGD3009E6  [SOT26P285X140-6L]
U6  ZXGD3009E6  [SOT26P285X140-6L]
U7  ZXGD3009E6  [SOT26P285X140-6L]
U10  SN74AHCT125RGYR  [QFN50P350X350X100_RGY_S-PVQFN-N14]  (parts A,B,C,D,E of 5)

### Ports
Fan1, Fan2, Heat1, Heat2, Heat3, HeatBed

### Nets
+5VCC: C18.2 C19.2 C20.2 C21.2 C22.1 C23.2 C31.2 U2.1(VCC) U3.1(VCC) U4.1(VCC) U5.1(VCC) U6.1(VCC) U7.1(VCC) U10.14(VCC)
FGND: D21.A
GND: C18.1 C19.1 C20.1 C21.1 C22.2 C23.1 C31.1 D4.A D10.A D11.A D14.A D31.A Q1.1(S) Q1.2(S) Q1.3(S) Q2.1(S) Q2.2(S) Q2.3(S) Q3.1(S) Q3.2(S) Q3.3(S) Q4.1(S) Q4.2(S) Q4.3(S) Q5.2(S) Q6.2(S) R26.1 R28.1 R29.1 R30.1 R39.1 R54.1 U2.3(VEE) U3.3(VEE) U4.3(VEE) U5.3(VEE) U6.3(VEE) U7.3(VEE) U10.1(1OE) U10.4(2OE) U10.7(GND) U10.10(3OE) U10.13(4OE)
VBED: C11.1 D15.C J1.10 R9.2
VPWR: C8.1 C9.1 C10.1 C14.1 C17.1 D6.C D7.C D8.C D12.C D19.C J1.2 J1.4 J1.6 J1.8 J2.2(S) R6.2 R7.2 R8.2 R12.2 R14.2
Fan1: R26.2 U2.2(IN) ; port Fan1
Fan2: R28.2 U6.2(IN) ; port Fan2
FN1: C14.2 D19.A D30.C D31.C J1.7 Q6.3(D) TP41.1
Heat1: R54.2 U10.2(1A) ; port Heat1
Heat2: R39.2 U10.5(2A) ; port Heat2
Heat3: R29.2 U10.12(4A) ; port Heat3
HeatBed: R30.2 U10.9(3A) ; port HeatBed
HTBD: C11.2 D4.C D9.C D15.A J1.9 Q4.TAB(D) TP37.1
HTR0: C8.2 D6.A D14.C D16.C J1.1 Q1.TAB(D) TP40.1
HTR1: C9.2 D7.A D10.C D17.C J1.3 Q2.TAB(D) TP39.1
HTRA: C10.2 D8.A D11.C D18.C J1.5 Q3.TAB(D) TP38.1
SNTP: U10.15(TP)
NetC17_2: C17.2 D12.A D20.C D21.C J2.1(S) Q5.3(D) TP42.1
NetD9_A: D9.A R9.1
NetD16_A: D16.A R6.1
NetD17_A: D17.A R7.1
NetD18_A: D18.A R8.1
NetD20_A: D20.A R14.1
NetD30_A: D30.A R12.1
NetQ1_4: Q1.4(G) R52.2 R53.2 TP58.1
NetQ2_4: Q2.4(G) R20.2 R55.2 TP62.1
NetQ3_4: Q3.4(G) R21.2 R24.2 TP64.1
NetQ4_4: Q4.4(G) R25.2 R27.2 TP66.1
NetQ5_1: Q5.1(G) R15.2 R16.2 TP33.1
NetQ6_1: Q6.1(G) R17.2 R18.2 TP34.1
NetR15_1: R15.1 U6.6(SOURCE)
NetR16_1: R16.1 U6.4(SINK)
NetR17_1: R17.1 U2.6(SOURCE)
NetR18_1: R18.1 U2.4(SINK)
NetR20_1: R20.1 U4.4(SINK)
NetR21_1: R21.1 U5.4(SINK)
NetR24_1: R24.1 U5.6(SOURCE)
NetR25_1: R25.1 U7.4(SINK)
NetR27_1: R27.1 U7.6(SOURCE)
NetR52_1: R52.1 U3.6(SOURCE)
NetR53_1: R53.1 U3.4(SINK)
NetR55_1: R55.1 U4.6(SOURCE)
NetTP35_1: TP35.1 U3.2(IN) U10.3(1Y)
NetTP59_1: TP59.1 U4.2(IN) U10.6(2Y)
NetTP63_1: TP63.1 U5.2(IN) U10.11(4Y)
NetTP65_1: TP65.1 U7.2(IN) U10.8(3Y)

### Notes on the sheet
- (in symbol CSD18503Q5A) Tab
- (in symbol CSD18534Q5A) Tab

### Library data of the parts
C8-C11 C14 C17 = C0603TBD: Capacitor Non Polarized; MANUFACTURER #: DNI-C0603TBD; VALUE: C0603TBD; DNI: DNI
C18-C23 C31 = GRM155R71C104KA88D: as C103 on sheet Thermistors; VALUE: 100nF; MANUFACTURER #: GRM155R71C104KA88D; DISTRIBUTOR #: 490-3261-2-ND; DISTRIBUTOR: Digi-Key Electronics; TOLERANCE: 10%
D4 D10 D11 D14 D21 D31 = RSB39VTE-17: DIODE TVS; MANUFACTURER: Rohm; PART: TVS DIODE 30VWM SOD323; TOLERANCE: -NA-; VALUE: 30V; EE_SPEC: 30Vso 30pF; MANUFACTURER #: RSB39VTE-17; DISTRIBUTOR #: RSB39VTE-17TR-ND; DISTRIBUTOR: Digi-Key Electronics; PART DESCRIPTION: TVS DIODE 30VWM SOD323
D6-D8 D12 D15 D19 = SK310A: DIODE Schottky 3A SMA; MANUFACTURER: MCC; PART: Schottky Diode 100V 3A; PART DESCRIPTION: Diode Schottky 100V 3A Surface Mount DO-214AC (HSMA); TOLERANCE: -NA-; VALUE: -NA-; EE_SPEC: 100V 3A; MANUFACTURER #: SK310A; DISTRIBUTOR #: SK310A-TPTR-ND; DISTRIBUTOR: Digi-Key Electronics
D9 D16-D18 D20 D30 = 5988110107F: LED 0805 Red; MANUFACTURER: Dialight; PART DESCRIPTION: Red 635nm LED Indication - Discrete 2.2V 0805 (2012 Metric); TOLERANCE: -NA-; EE_SPEC: Vf=2.2V; VALUE: Red; MANUFACTURER #: 5988110107F; DISTRIBUTOR #: 350-2038-2-ND; DISTRIBUTOR: Digi-Key Electronics
J1 = CONN 10POS 0.2" VERT SHRD: MSBTV10 10 port connector same as RAMBo; PART: CONN TERM BLOCK HDR 10POS VERT 5.08MM; PART DESCRIPTION: 10 Position Terminal Block Header, Male Pins, Shrouded (4 Side) 0.200" (5.08mm) Vertical Through Hole; TOLERANCE: -NA-; MANUFACTURER #: 0395311010; MANUFACTURER: Molex; DISTRIBUTOR #: WM7843-ND; DISTRIBUTOR: Digi-Key Electronics; EE_SPEC: -NA-
J2 = CONN 2PIN VERT 0.1" SHRD LOCKING PIP: as J14 on sheet Thermistors; DISTRIBUTOR #: WM4800-ND; DISTRIBUTOR: Digikey; EE_SPEC: -NA-
Q1-Q3 = CSD18534Q5A: MOSFET N-CH 40V 100A 8VSON; MANUFACTURER: TI; PART DESCRIPTION: MOSFET N-CH 60V 13A 8VSON; VALUE: N-FET; MANUFACTURER #: CSD18534Q5A; PART: CSD18534Q5A
Q4 = CSD18503Q5A: MOSFET N-CH 40V 100A 8VSON; MANUFACTURER: TI; VALUE: N-FET; MANUFACTURER #: CSD18503Q5A; PART DESCRIPTION: MOSFET N-CH 40V 100A 8VSON; EE_SPEC: 40V 100A
Q5 Q6 = IRLML6346TRPBF: Mosfet N-Channel 30V 3.4A 63mOhm; MANUFACTURER: Infineon; PART: MOSFET N-Chan 30V 3.4A; PART DESCRIPTION: N-Channel 30V 3.4A (Ta) 1.3W (Ta) Surface Mount Micro3™/SOT-23; TOLERANCE: -NA-; VALUE: N-FET; MANUFACTURER #: IRLML6346TRPBF; DISTRIBUTOR #: IRLML6346TRPBFTR-ND; DISTRIBUTOR: Digi-Key Electronics; EE_SPEC: 30V 3.4A 63mOhm
R6-R9 R12 R14 = RC0603JR-071K8L: RES 0603 1.8K 100mW 5%; MANUFACTURER: Yageo; PART: 1.8k 5% 0603; PART DESCRIPTION: 1.8k Ohm ±5% 0.1W, 1/10W Chip Resistor 0603 (1608 Metric) Moisture Resistant Thick Film; EE_SPEC: 1/10W; VALUE: 1.8K; MANUFACTURER #: RC0603JR-071K8L; DISTRIBUTOR #: 311-1.8KGRTR-ND; DISTRIBUTOR: Digi-Key Electronics; TOLERANCE: 5%
R15 R17 R24 R27 R52 R55 = RC0402FR-0710RL: RES SMD 10 OHM 1% 1/16W 0402; MANUFACTURER: Yageo; PART DESCRIPTION: 10 Ohm ±1% 0.063W, 1/16W Chip Resistor 0402 (1005 Metric) Moisture Resistant Thick Film; EE_SPEC: 10R 1% 0402; VALUE: 10R; MANUFACTURER #: RC0402FR-0710RL; DISTRIBUTOR #: 311-10.0LRTR-ND; DISTRIBUTOR: Digi-Key Electronics; PART: 10R; TOLERANCE: 1%
R16 R18 R20 R21 R25 R53 = RES 100R 0402 1%: RES SMD 100 OHM 1% 1/16W 0402; MANUFACTURER: Yageo; MANUFACTURER #: RC0402FR-07100RL; PART: 100R 1% 0402; PART DESCRIPTION: 100 Ohm ±1% 0.063W, 1/16W Chip Resistor 0402 (1005 Metric) Moisture Resistant Thick Film; VALUE: 100R; DISTRIBUTOR #: 311-100LRTR-ND; DISTRIBUTOR: Digi-Key Electronics; TOLERANCE: 1%; EE_SPEC: 1/16W
R26 R28-R30 R39 R54 = RC0402FR-0710KP: as R130 on sheet Motor-Z; VALUE: 10K; MANUFACTURER #: RC0402FR-0710KP; DISTRIBUTOR #: YAG1249TR-ND; DISTRIBUTOR: Digi-Key Electronics; TOLERANCE: 1%; EE_SPEC: 1/16W
TP33-TP35 TP37-TP42 TP58 TP59 TP62-TP66 = Socket: MANUFACTURER #: NOTAPART-Testpoint
U2-U7 = ZXGD3009E6: MOSFET DRVR 3A 1-OUT High Speed Non-Inv6-Pin SOT-26 T/R; MANUFACTURER #: ZXGD3009E6TA; MANUFACTURER: Diodes Incorporated; PART: IC GATE DRVR IGBT/MOSFET SOT23-6; PART DESCRIPTION: Low-Side Gate Driver IC Non-Inverting SOT-26; TOLERANCE: -NA-; EE_SPEC: 40V 2A; DISTRIBUTOR #: ZXGD3009E6TADITR-ND; DISTRIBUTOR: Digi-Key Electronics; VALUE: ZXGD3009E6
U10 = SN74AHCT125: Quadruple Bus Buffer Gates With 3-State Outputs 14-VQFN -40 to 125; MANUFACTURER: Texas Instruments; PART: IC BUS BUFFER TRI-ST QD 14VQFN; PART DESCRIPTION: Buffer, Non-Inverting 4 Element 1 Bit per Element Push-Pull Output 14-VQFN (3.5x3.5); TOLERANCE: -NA-; VALUE: Tri-State Buffer; EE_SPEC: 5V 8mA; MANUFACTURER #: SN74AHCT125RGYR; DISTRIBUTOR #: 296-13910-2-ND; DISTRIBUTOR: Digi-Key Electronics